# Altium project FMU3_REV_D.PrjPcb (part 1 of 2)
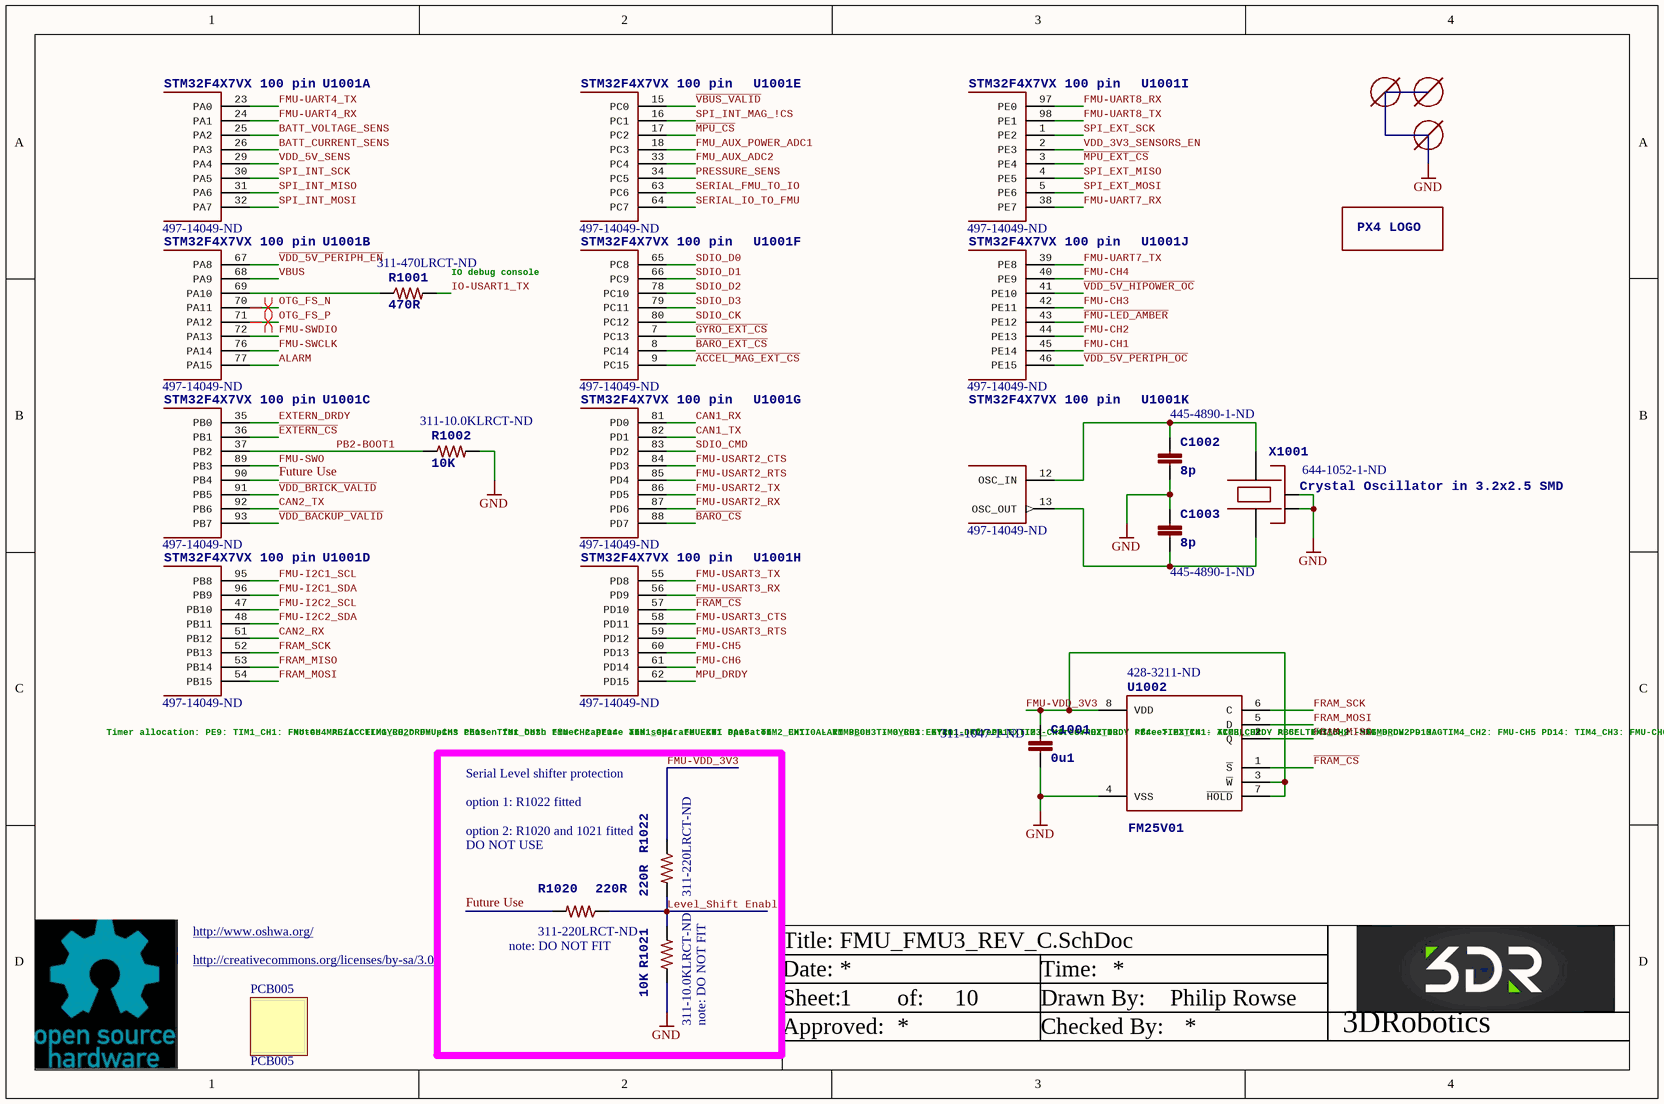
[diagram p0: FMU_FMU3_REV_C.SchDoc]
11 sheets, 168 parts. Net scope: global (net labels, ports and power ports of the same name join across sheets).
Board file: FMU3_REV_D.PcbDoc
Sheets:
  FMU_FMU3_REV_C.SchDoc
  SD_USB_FMU3_REV_C.SchDoc
  SERIAL_FMU3_REV_C.SchDoc
  SENSORS_FMU3_REV_C.SchDoc
  FMU_Power_FMU3_REV_C.SchDoc
  LEDs_FMU3_REV_C.SchDoc
  IO_FMU3_REV_C.SchDoc
  PWM_PPM_FMU3_REV_C.SchDoc
  80PIN_FMU3_REV_C.SchDoc
  IO_PWR_FMU3_REV_C.SchDoc
  CHANGE_FMU3_REV_D.SchDoc

## Sheet FMU_FMU3_REV_C.SchDoc
size A4; DrawnBy: Philip Rowse; SheetNumber: 1; SheetTotal: 10

### Parts
C1001  0u1  Supplier Part Number 1: 311-1047-1-ND  [0402-CAP]
C1002  8p  Supplier Part Number 1: 445-4890-1-ND  [0402-CAP]
C1003  8p  Supplier Part Number 1: 445-4890-1-ND  [0402-CAP]
M3_MOUNT1001  MOUNT-HOLE1.8MM  [MOUNT-HOLE1.8]  (value not drawn)
M3_MOUNT1003  MOUNT-HOLE1.8MM  [MOUNT-HOLE1.8]  (value not drawn)
M3_MOUNT1004  MOUNT-HOLE1.8MM  [MOUNT-HOLE1.8]  (value not drawn)
PCB005  PCB005
R1001  470R  Supplier Part Number 1: 311-470LRCT-ND  [0402-RES]
R1002  10K  Supplier Part Number 1: 311-10.0KLRCT-ND  [0402-RES]
R1020  220R  Supplier Part Number 1: 311-220LRCT-ND  note: DO NOT FIT  [0402-RES]
R1021  10K  Supplier Part Number 1: 311-10.0KLRCT-ND  note: DO NOT FIT  [0402-RES]
R1022  220R  Supplier Part Number 1: 311-220LRCT-ND  [0402-RES]
U1001  STM32F4X7VX 100 pin  Supplier Part Number 1: 497-14049-ND  [TQFP100]  (parts A,B,C,D,E,F,G,H,I,J,K of 14)
U1002  FM25V01  Supplier Part Number 1: 428-3211-ND  [SO08]
U$4  PX4-LOGO-10MM  [PX4-LOGO-10MM]  (value not drawn)
X1001  Crystal Oscillator in 3.2x2.5 SMD  Supplier Part Number 1: 644-1052-1-ND  [OSCILLATOR-3.2X2.5]

### Nets
GND: C1001.P$2 C1002.P$2 C1003.P$1 R1002.P$2 R1021.P$1 U1002.4(VSS) X1001.2(NC_2) X1001.4(NC_4)
~{ACCEL_MAG_EXT_CS}: U1001.9(PC15)
ALARM: U1001.77(PA15)
~{BARO_CS}: U1001.88(PD7)
~{BARO_EXT_CS}: U1001.8(PC14)
BATT_CURRENT_SENS: U1001.26(PA3)
BATT_VOLTAGE_SENS: U1001.25(PA2)
CAN1_RX: U1001.81(PD0)
CAN1_TX: U1001.82(PD1)
CAN2_RX: U1001.51(PB12)
CAN2_TX: U1001.92(PB6)
~{EXTERN_CS}: U1001.36(PB1)
EXTERN_DRDY: U1001.35(PB0)
~{FMU-LED_AMBER}: U1001.43(PE12)
~{FRAM_CS}: U1001.57(PD10) U1002.1(~{S})
FMU-CH1: U1001.45(PE14)
FMU-CH2: U1001.44(PE13)
FMU-CH3: U1001.42(PE11)
FMU-CH4: U1001.40(PE9)
FMU-CH5: U1001.60(PD13)
FMU-CH6: U1001.61(PD14)
FMU-I2C1_SCL: U1001.95(PB8)
FMU-I2C1_SDA: U1001.96(PB9)
FMU-I2C2_SCL: U1001.47(PB10)
FMU-I2C2_SDA: U1001.48(PB11)
FMU-SWCLK: U1001.76(PA14)
FMU-SWDIO: U1001.72(PA13)
FMU-SWO: U1001.89(PB3)
FMU-UART4_RX: U1001.24(PA1)
FMU-UART4_TX: U1001.23(PA0)
FMU-UART7_RX: U1001.38(PE7)
FMU-UART7_TX: U1001.39(PE8)
FMU-UART8_RX: U1001.97(PE0)
FMU-UART8_TX: U1001.98(PE1)
FMU-USART2_CTS: U1001.84(PD3)
FMU-USART2_RTS: U1001.85(PD4)
FMU-USART2_RX: U1001.87(PD6)
FMU-USART2_TX: U1001.86(PD5)
FMU-USART3_CTS: U1001.58(PD11)
FMU-USART3_RTS: U1001.59(PD12)
FMU-USART3_RX: U1001.56(PD9)
FMU-USART3_TX: U1001.55(PD8)
FMU-VDD_3V3: C1001.P$1 R1022.P$1 U1002.3(~{W}) U1002.7(~{HOLD}) U1002.8(VDD)
FMU_AUX_ADC2: U1001.33(PC4)
FMU_AUX_POWER_ADC1: U1001.18(PC3)
FRAM_MISO: U1001.53(PB14) U1002.2(Q)
FRAM_MOSI: U1001.54(PB15) U1002.5(D)
FRAM_SCK: U1001.52(PB13) U1002.6(C)
Future Use: R1020.P$2 U1001.90(PB4)
~{GYRO_EXT_CS}: U1001.7(PC13)
IO-USART1_TX: R1001.P$2
Level_Shift Enable: R1020.P$1 R1021.P$2 R1022.P$2
~{MPU_CS}: U1001.17(PC2)
~{MPU_EXT_CS}: U1001.3(PE4)
MPU_DRDY: U1001.62(PD15)
OTG_FS_N: U1001.70(PA11)
OTG_FS_P: U1001.71(PA12)
PB2-BOOT1: R1002.P$1 U1001.37(PB2)
PRESSURE_SENS: U1001.34(PC5)
SDIO_CK: U1001.80(PC12)
SDIO_CMD: U1001.83(PD2)
SDIO_D0: U1001.65(PC8)
SDIO_D1: U1001.66(PC9)
SDIO_D2: U1001.78(PC10)
SDIO_D3: U1001.79(PC11)
SERIAL_FMU_TO_IO: U1001.63(PC6)
SERIAL_IO_TO_FMU: U1001.64(PC7)
SPI_EXT_MISO: U1001.4(PE5)
SPI_EXT_MOSI: U1001.5(PE6)
SPI_EXT_SCK: U1001.1(PE2)
SPI_INT_MAG_!CS: U1001.16(PC1)
SPI_INT_MISO: U1001.31(PA6)
SPI_INT_MOSI: U1001.32(PA7)
SPI_INT_SCK: U1001.30(PA5)
~{VBUS_VALID}: U1001.15(PC0)
~{VDD_5V_HIPOWER_OC}: U1001.41(PE10)
~{VDD_5V_PERIPH_EN}: U1001.67(PA8)
~{VDD_5V_PERIPH_OC}: U1001.46(PE15)
~{VDD_BACKUP_VALID}: U1001.93(PB7)
~{VDD_BRICK_VALID}: U1001.91(PB5)
VBUS: U1001.68(PA9)
VDD_3V3_SENSORS_EN: U1001.2(PE3)
VDD_5V_SENS: U1001.29(PA4)
NetC1002_P$1: C1002.P$1 U1001.12(OSC_IN) X1001.3
NetC1003_P$2: C1003.P$2 U1001.13(OSC_OUT) X1001.1
NetR1001_P$1: R1001.P$1 U1001.69(PA10)

### Layout directives
differential pair: OTG_FS_N, OTG_FS_P

### Notes on the sheet
- (near R1001) IO debug console
- Timer allocation:
  PE9: TIM1_CH1: FMU-CH4
  PE11: TIM1_CH2: FMU-CH3
  PE13: TIM1_CH3: FMU-CH2
  PE14: TIM1_CH4: FMU-CH1
  PA15: TIM2_CH1: ALARM
  PB0: TIM3_CH3: GYRO1_DRDY
  PB1: TIM3_CH4: GYRO2_DRDY
  PB4: TIM3_CH1: ACCEL_DRDY
  PB5: TIM3_CH2: MAG_DRDY
  PD13: TIM4_CH2: FMU-CH5
  PD14: TIM4_CH3: FMU-CH6
  PD15: TIM4_CH4: spare
- Note: MAG/ACCEL/GYRO_DRDY pins chosen
  for both timer capture and separate
  EXTI operaton.
  EXTI0 - TIM3_CH3 - GYRO1
  EXTI1 - <free>
  EXTI2 - <free>
  EXTI3 - <free>
  EXTI4 - TIM3_CH1 - ACCEL
  EXTI5-9 - TIM3_CH2 - MAG
- option 1: R1022 fitted
- (near R1022) option 2: R1020 and 1021 fitted
- Serial Level shifter protection
- DO NOT USE
- http://www.oshwa.org/
- http://creativecommons.org/licenses/by-sa/3.0/
- Title:
- Date:
- Time:
- Sheet:
- Approved:
- of:
- Drawn By:
- Checked By:
- 3DRobotics

### Library data of the parts
C1001 = CAP0402: CAP CER 0.1UF 16V Y5V 0402; PARTNO: CC0402ZRY5V7BB104; 3DR_PARTNO: ECM0700; Supplier 1: Digi-Key; Value: 0u1
C1002 C1003 = CAP0402: CAP CER 8PF 50V C0G 0402; PARTNO: C1005C0G1H080C; 3DR_PARTNO: ECM0710; Supplier 1: Digi-Key; Value: 8p
M3_MOUNT1001 M3_MOUNT1003 M3_MOUNT1004 = MOUNT-HOLE1.8MM: BOM: EXCLUDE; PARTNO: *
PCB005 = PCB_0005: PCB,FMU, PX2, Board; 3DR_PARTNO: PCB005; Value: PCB005
R1001 = RESISTOR0402-RES: RES 470 OHM 1/16W 1% 0402 SMD; PARTNO: RC0402FR-07470RL; 3DR_PARTNO: ECM0823; Supplier 1: Digi-Key; Value: 470R
R1002 R1021 = RESISTOR0402-RES: RES 10K OHM 1/16W 1% 0402 SMD; PARTNO: RC0402FR-0710KL; 3DR_PARTNO: ECM0800; Supplier 1: Digi-Key; Value: 10K
R1020 R1022 = RESISTOR0402-RES: RES 220 OHM 1/16W 1% 0402 SMD; PARTNO: RC0402FR-07220RL; 3DR_PARTNO: ECM0821; Supplier 1: Digi-Key; Value: 220R
U1001 = STM32F4X7VX: REV 3 Silicon or later IC MCU ARM 2MB FLASH 100LQFP; 3DR_PARTNO: ECM0841; Supplier 1: Digi-Key
U1002 = FM25V01: IC FRAM 128KBIT 40MHZ 8SOIC; PARTNO: FM25V01-G; 3DR_PARTNO: ECM0826; Value: 128k; DATASHEET: http://www.ramtron.com/files/datasheets/FM25V01_ds.pdf; LINK: http://www.digikey.com/product-detail/en/FM25V01-GTR/1140-1026-1-ND/2809832; MFGPN: FM25V01; Supplier 1: Digi-Key
X1001 = OSCILLATOR-3.2X2.5: CRYSTAL 24MHZ 8PF SMD; 3DR_PARTNO: ECM0708; PARTNO: NX3225SA-24.000MHZ-STD-CSR-1; Supplier 1: Digi-Key; Value: 24MHz
U$4 = PX4-LOGO-10MM: PX4 LOGO: PX4 LOGO

## Sheet SD_USB_FMU3_REV_C.SchDoc: Pixhawk_mini_8L.sch
size A4; Date: 18/08/2014 1:53:11 PM; DrawnBy: Philip Rowse; SheetNumber: 2; SheetTotal: 10
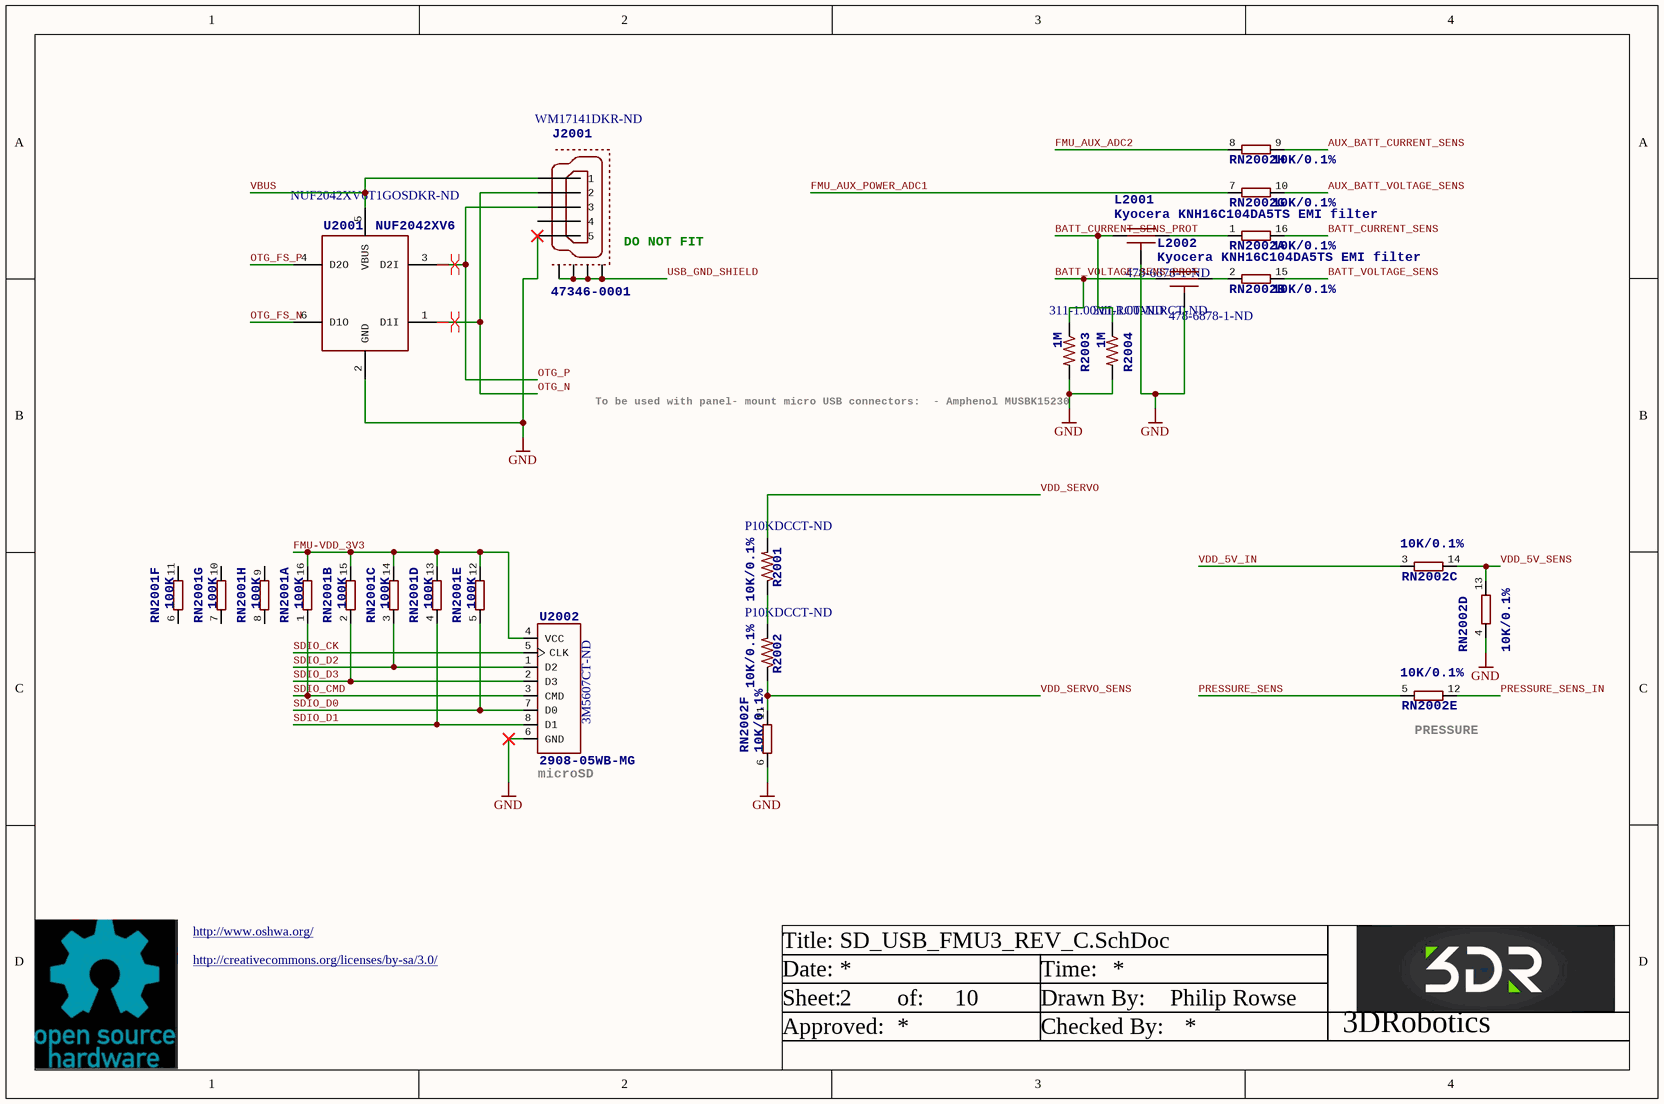
[diagram p1: SD_USB_FMU3_REV_C.SchDoc]

### Parts
J2001  47346-0001  Supplier Part Number 1: WM17141DKR-ND  [MOLEX-47346-0001]
L2001  Kyocera KNH16C104DA5TS EMI filter  Supplier Part Number 1: 478-6878-1-ND  [KYOCERA-KNH16-DA]
L2002  Kyocera KNH16C104DA5TS EMI filter  Supplier Part Number 1: 478-6878-1-ND  [KYOCERA-KNH16-DA]
R2001  10K/0.1%  Supplier Part Number 1: P10KDCCT-ND  [0402-RES]
R2002  10K/0.1%  Supplier Part Number 1: P10KDCCT-ND  [0402-RES]
R2003  1M  Supplier Part Number 1: 311-1.00MLRCT-ND  [0402-RES]
R2004  1M  Supplier Part Number 1: 311-1.00MLRCT-ND  [0402-RES]
RN2001  100K  [EXB2HV]  (parts A,B,C,D,E,F,G,H of 8)
RN2002  10K/0.1%  [EXB2HV]  (parts A,B,C,D,E,F,G,H of 8)
U2001  NUF2042XV6  Supplier Part Number 1: NUF2042XV6T1GOSDKR-ND  [SOT563-6]
U2002  2908-05WB-MG  Supplier Part Number 1: 3M5607CT-ND  [MICROSD]

### Nets
GND: J2001.GND(5) L2001.GND L2002.GND R2003.P$2 R2004.P$2 RN2002.4 RN2002.6 U2001.2(GND) U2002.6(GND)
AUX_BATT_CURRENT_SENS: RN2002.9
AUX_BATT_VOLTAGE_SENS: RN2002.10
BATT_CURRENT_SENS: RN2002.16
BATT_CURRENT_SENS_PROT: L2001.P$1 R2004.P$1
BATT_VOLTAGE_SENS: RN2002.15
BATT_VOLTAGE_SENS_PROT: L2002.P$1 R2003.P$1
FMU-VDD_3V3: RN2001.12 RN2001.13 RN2001.14 RN2001.15 RN2001.16 U2002.4(VCC)
FMU_AUX_ADC2: RN2002.8
FMU_AUX_POWER_ADC1: RN2002.7
OTG_FS_N: U2001.6(D1O)
OTG_FS_P: U2001.4(D2O)
OTG_N: J2001.D-(2) U2001.1(D1I)
OTG_P: J2001.D+(3) U2001.3(D2I)
PRESSURE_SENS: RN2002.5
PRESSURE_SENS_IN: RN2002.12
SDIO_CK: U2002.5(CLK)
SDIO_CMD: RN2001.1 U2002.3(CMD)
SDIO_D0: RN2001.5 U2002.7(D0)
SDIO_D1: RN2001.4 U2002.8(D1)
SDIO_D2: RN2001.3 U2002.1(D2)
SDIO_D3: RN2001.2 U2002.2(D3)
USB_GND_SHIELD: J2001.GND1 J2001.GND2 J2001.GND3 J2001.GND4
VBUS: J2001.VBUS(1) U2001.5(VBUS)
VDD_5V_IN: RN2002.3
VDD_5V_SENS: RN2002.13 RN2002.14
VDD_SERVO: R2001.P$2
VDD_SERVO_SENS: R2002.P$1 RN2002.11
NetL2001_P$2: L2001.P$2 RN2002.1
NetL2002_P$2: L2002.P$2 RN2002.2
NetR2001_P$1: R2001.P$1 R2002.P$2

Not connected (* = marked no-connect by the designer): J2001 ID(4); RN2001 6(1) 7(1) 8(1) 9(2) 10(2) 11(2)

### Layout directives
differential pair: OTG_N, OTG_P

### Notes on the sheet
- (near J2001) DO NOT FIT
- To be used with panel-
  mount micro USB connectors:
  - Amphenol MUSBK15230
- (near RN2002) PRESSURE
- (near U2002) microSD
- http://www.oshwa.org/
- http://creativecommons.org/licenses/by-sa/3.0/
- Title:
- Date:
- Time:
- Sheet:
- Approved:
- of:
- Drawn By:
- Checked By:
- 3DRobotics

### Library data of the parts
J2001 = MOLEX-47346-0001: MICRO USB B, BOTTOM MOUNT; 3DR_PARTNO: ECM0486; PARTNO: 0473460001; Supplier 1: Digi-Key
L2001 L2002 = KNH16C104DA5TS: FILTER CAP 0.1UF 2A 25V 0603; 3DR_PARTNO: ECM0719; Value: 0u1; Supplier 1: Digi-Key; PARTNO: KNH16C104DA5TS
R2001 R2002 = RESISTOR0402-RES: RES 10K OHM 1/16W .1% 0402 SMD; 3DR_PARTNO: ECM0810; PARTNO: ERA-2AEB103X; Supplier 1: Digi-Key; Value: 10K
R2003 R2004 = RESISTOR0402-RES: RES 1M OHM 1/16W 1% 0402 SMD; PARTNO: RC0402FR-071ML; 3DR_PARTNO: ECM0806; Supplier 1: Digi-Key; Value: 1M
RN2001 = 8R-NEXB2HV-100K: RES ARRAY 100K OHM 8 RES 1506; PARTNO: EXB-2HV104JV; 3DR_PARTNO: ECM0101; OC_FARNELL: unknown; OC_NEWARK: unknown; Supplier 1: Digi-Key; Supplier Part Number 1: Y1104CT-ND; Value: 100K
RN2002 = 8R-NEXB2HV-10K: RES ARRAY 10K OHM 8 RES 1506; PARTNO: EXB-2HV103JV; 3DR_PARTNO: ECM0546; OC_FARNELL: unknown; OC_NEWARK: unknown; Supplier 1: Digi-Key; Supplier Part Number 1: Y1103CT-ND; Value: 10K
U2001 = NUF2042XV6: IC FILTER USB ESD PROTECT SOT363; PARTNO: NUF2042XV6T1G; 3DR_PARTNO: ECM0836; Supplier 1: Digi-Key
U2002 = MICROSDSDI: CONN MICRO SD CARD PUSH-PUSH R/A; 3DR_PARTNO: ECM0485; PARTNO: 2908-05WB-MG; Supplier 1: Digi-Key

## Sheet SERIAL_FMU3_REV_C.SchDoc: Pixhawk_mini_8L.sch
size A4; Date: 18/08/2014 1:53:13 PM; DrawnBy: Philip Rowse; SheetNumber: 3; SheetTotal: 10
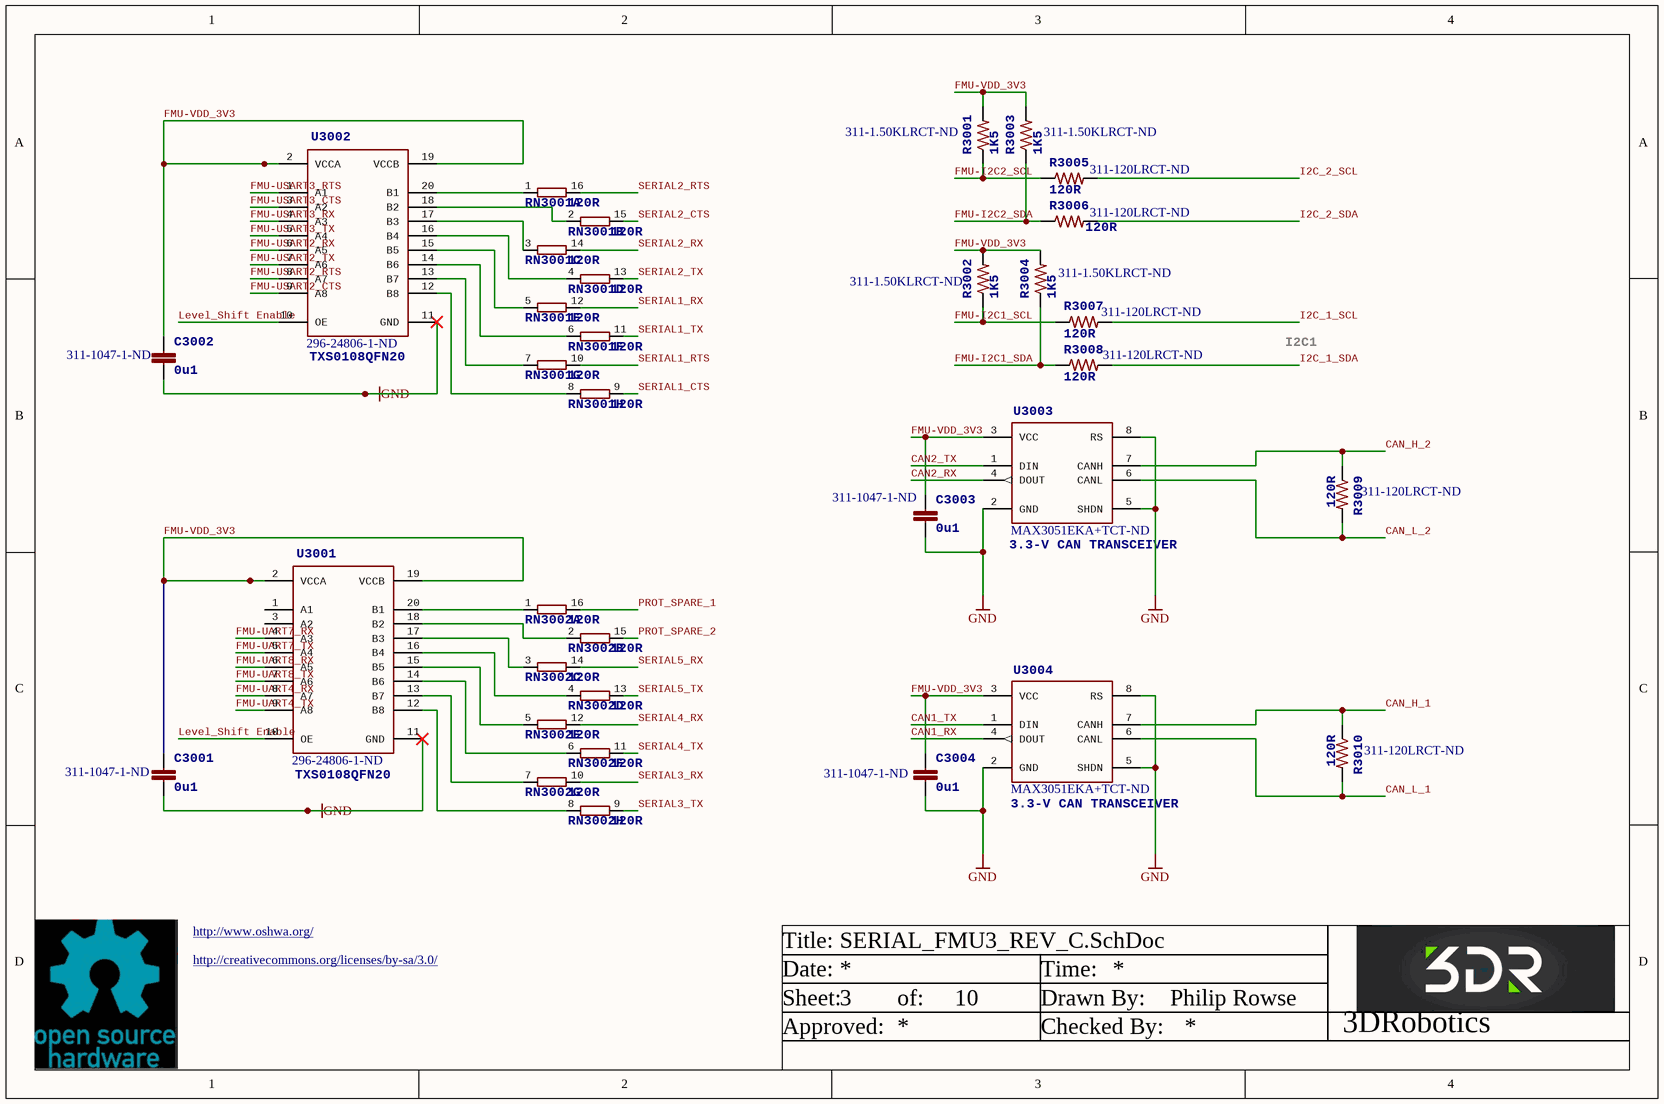
[diagram p2: SERIAL_FMU3_REV_C.SchDoc]

### Parts
C3001  0u1  Supplier Part Number 1: 311-1047-1-ND  [0402-CAP]
C3002  0u1  Supplier Part Number 1: 311-1047-1-ND  [0402-CAP]
C3003  0u1  Supplier Part Number 1: 311-1047-1-ND  [0402-CAP]
C3004  0u1  Supplier Part Number 1: 311-1047-1-ND  [0402-CAP]
R3001  1K5  Supplier Part Number 1: 311-1.50KLRCT-ND  [0402-RES]
R3002  1K5  Supplier Part Number 1: 311-1.50KLRCT-ND  [0402-RES]
R3003  1K5  Supplier Part Number 1: 311-1.50KLRCT-ND  [0402-RES]
R3004  1K5  Supplier Part Number 1: 311-1.50KLRCT-ND  [0402-RES]
R3005  120R  Supplier Part Number 1: 311-120LRCT-ND  [0402-RES]
R3006  120R  Supplier Part Number 1: 311-120LRCT-ND  [0402-RES]
R3007  120R  Supplier Part Number 1: 311-120LRCT-ND  [0402-RES]
R3008  120R  Supplier Part Number 1: 311-120LRCT-ND  [0402-RES]
R3009  120R  Supplier Part Number 1: 311-120LRCT-ND  [0402-RES]
R3010  120R  Supplier Part Number 1: 311-120LRCT-ND  [0402-RES]
RN3001  120R  [EXB2HV]  (parts A,B,C,D,E,F,G,H of 8)
RN3002  120R  [EXB2HV]  (parts A,B,C,D,E,F,G,H of 8)
U3001  TXS0108QFN20  Supplier Part Number 1: 296-24806-1-ND  [QFN20-RGY]
U3002  TXS0108QFN20  Supplier Part Number 1: 296-24806-1-ND  [QFN20-RGY]
U3003  3.3-V CAN TRANSCEIVER  Supplier Part Number 1: MAX3051EKA+TCT-ND  [SOT23-8]
U3004  3.3-V CAN TRANSCEIVER  Supplier Part Number 1: MAX3051EKA+TCT-ND  [SOT23-8]

### Nets
GND: C3001.P$2 C3002.P$2 C3003.P$2 C3004.P$2 U3001.11(GND) U3002.11(GND) U3003.2(GND) U3003.5(SHDN) U3003.8(RS) U3004.2(GND) U3004.5(SHDN) U3004.8(RS)
CAN1_RX: U3004.4(DOUT)
CAN1_TX: U3004.1(DIN)
CAN2_RX: U3003.4(DOUT)
CAN2_TX: U3003.1(DIN)
CAN_H_1: R3010.P$1 U3004.7(CANH)
CAN_H_2: R3009.P$1 U3003.7(CANH)
CAN_L_1: R3010.P$2 U3004.6(CANL)
CAN_L_2: R3009.P$2 U3003.6(CANL)
FMU-I2C1_SCL: R3002.P$1 R3007.P$1
FMU-I2C1_SDA: R3004.P$1 R3008.P$1
FMU-I2C2_SCL: R3001.P$1 R3005.P$1
FMU-I2C2_SDA: R3003.P$1 R3006.P$1
FMU-UART4_RX: U3001.8(A7)
FMU-UART4_TX: U3001.9(A8)
FMU-UART7_RX: U3001.4(A3)
FMU-UART7_TX: U3001.5(A4)
FMU-UART8_RX: U3001.6(A5)
FMU-UART8_TX: U3001.7(A6)
FMU-USART2_CTS: U3002.9(A8)
FMU-USART2_RTS: U3002.8(A7)
FMU-USART2_RX: U3002.6(A5)
FMU-USART2_TX: U3002.7(A6)
FMU-USART3_CTS: U3002.3(A2)
FMU-USART3_RTS: U3002.1(A1)
FMU-USART3_RX: U3002.4(A3)
FMU-USART3_TX: U3002.5(A4)
FMU-VDD_3V3: C3001.P$1 C3002.P$1 C3003.P$1 C3004.P$1 R3001.P$2 R3002.P$2 R3003.P$2 R3004.P$2 U3001.2(VCCA) U3001.19(VCCB) U3002.2(VCCA) U3002.19(VCCB) U3003.3(VCC) U3004.3(VCC)
I2C_1_SCL: R3007.P$2
I2C_1_SDA: R3008.P$2
I2C_2_SCL: R3005.P$2
I2C_2_SDA: R3006.P$2
Level_Shift Enable: U3001.10(OE) U3002.10(OE)
PROT_SPARE_1: RN3002.16
PROT_SPARE_2: RN3002.15
SERIAL1_CTS: RN3001.9
SERIAL1_RTS: RN3001.10
SERIAL1_RX: RN3001.12
SERIAL1_TX: RN3001.11
SERIAL2_CTS: RN3001.15
SERIAL2_RTS: RN3001.16
SERIAL2_RX: RN3001.14
SERIAL2_TX: RN3001.13
SERIAL3_RX: RN3002.10
SERIAL3_TX: RN3002.9
SERIAL4_RX: RN3002.12
SERIAL4_TX: RN3002.11
SERIAL5_RX: RN3002.14
SERIAL5_TX: RN3002.13
NetRN3001_1: RN3001.1 U3002.20(B1)
NetRN3001_2: RN3001.2 U3002.18(B2)
NetRN3001_3: RN3001.3 U3002.17(B3)
NetRN3001_4: RN3001.4 U3002.16(B4)
NetRN3001_5: RN3001.5 U3002.15(B5)
NetRN3001_6: RN3001.6 U3002.14(B6)
NetRN3001_7: RN3001.7 U3002.13(B7)
NetRN3001_8: RN3001.8 U3002.12(B8)
NetRN3002_1: RN3002.1 U3001.20(B1)
NetRN3002_2: RN3002.2 U3001.18(B2)
NetRN3002_3: RN3002.3 U3001.17(B3)
NetRN3002_4: RN3002.4 U3001.16(B4)
NetRN3002_5: RN3002.5 U3001.15(B5)
NetRN3002_6: RN3002.6 U3001.14(B6)
NetRN3002_7: RN3002.7 U3001.13(B7)
NetRN3002_8: RN3002.8 U3001.12(B8)

Not connected (* = marked no-connect by the designer): U3001 1(A1) 3(A2)

### Notes on the sheet
- I2C1
- http://www.oshwa.org/
- http://creativecommons.org/licenses/by-sa/3.0/
- Title:
- Date:
- Time:
- Sheet:
- Approved:
- of:
- Drawn By:
- Checked By:
- 3DRobotics

### Library data of the parts
C3001-C3004 = CAP0402: as C1001 on sheet FMU_FMU3_REV_C; Supplier 1: Digi-Key; Value: 0u1
R3001-R3004 = RESISTOR0402-RES: RES 1.5K OHM 1/16W 1% 0402 SMD; PARTNO: RC0402FR-071K5L; 3DR_PARTNO: ECM0803; Supplier 1: Digi-Key; Value: 1K5
R3005-R3010 = RESISTOR0402-RES: RES 120 OHM 1/16W 1% 0402 SMD; PARTNO: RC0402FR-07120RL; 3DR_PARTNO: ECM0820; Supplier 1: Digi-Key; Value: 120R
RN3001 RN3002 = 8R-NEXB2HV-120R: RES ARRAY 120 OHM 8 RES 1506; PARTNO: EXB-2HV121JV; 3DR_PARTNO: EMC; OC_FARNELL: unknown; OC_NEWARK: unknown; Supplier 1: Digi-Key; Supplier Part Number 1: Y1121CT-ND; Value: 120R
U3001 U3002 = TXS0108QFN20: IC XLATR VOLT-LVL 8B BDIR 20QFN; 3DR_PARTNO: ECM0845; PARTNO: TXS0108ERGYR; Supplier 1: Digi-Key
U3003 U3004 = MAX3051MAX3051EKA: IC TXRX CAN 1MBPS SOT23-8; 3DR_PARTNO: ECM0831; PARTNO: MAX3051EKA+T; Supplier 1: Digi-Key; Value: CAN

## Sheet SENSORS_FMU3_REV_C.SchDoc: Pixhawk_mini_8L.sch
size A4; Date: 18/08/2014 1:53:16 PM; DrawnBy: Philip Rowse; SheetNumber: 4; SheetTotal: 10
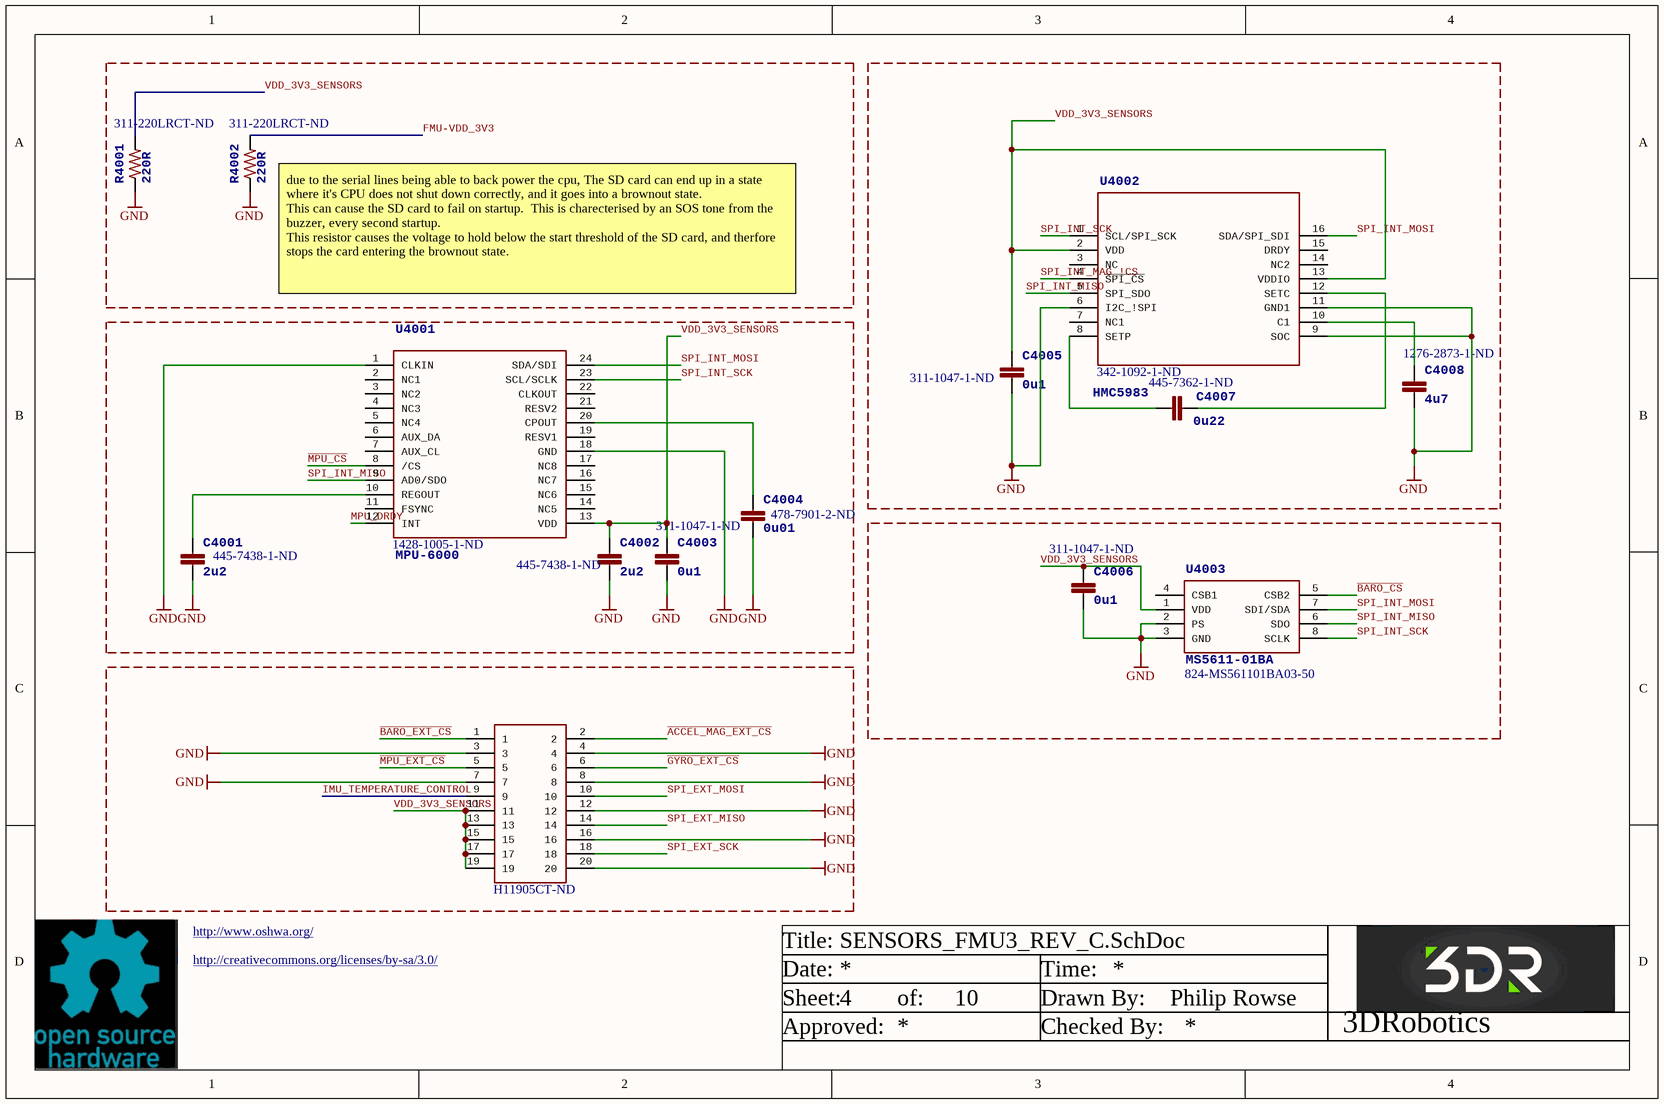
[diagram p3: SENSORS_FMU3_REV_C.SchDoc]

### Parts
C4001  2u2  Supplier Part Number 1: 445-7438-1-ND  [0603-CAP]
C4002  2u2  Supplier Part Number 1: 445-7438-1-ND  [0603-CAP]
C4003  0u1  Supplier Part Number 1: 311-1047-1-ND  [0402-CAP]
C4004  0u01  Supplier Part Number 1: 478-7901-2-ND  [0603-CAP]
C4005  0u1  Supplier Part Number 1: 311-1047-1-ND  [0402-CAP]
C4006  0u1  Supplier Part Number 1: 311-1047-1-ND  [0402-CAP]
C4007  0u22  Supplier Part Number 1: 445-7362-1-ND  [0402-CAP]
C4008  4u7  Supplier Part Number 1: 1276-2873-1-ND  [0805]
R4001  220R  Supplier Part Number 1: 311-220LRCT-ND  [0402-RES]
R4002  220R  Supplier Part Number 1: 311-220LRCT-ND  [0402-RES]
U4001  MPU-6000  Supplier Part Number 1: 1428-1005-1-ND  [QFN-24]
U4002  HMC5983  Supplier Part Number 1: 342-1092-1-ND  [HMC5983-new]
U4003  MS5611-01BA  Supplier Part Number 1: 824-MS561101BA03-50  [MS5611-01BA]
U$2  Supplier Part Number 1: H11905CT-ND  [DF-40C-20DS]  (hidden comment: DF40C-20-DS)

### Nets
GND: C4001.P$2 C4002.P$2 C4003.P$2 C4004.P$2 C4005.P$2 C4006.P$2 C4008.2 R4001.P$1 R4002.P$1 U4001.1(CLKIN) U4001.18(GND) U4002.6(I2C_!SPI) U4002.9(SOC) U4002.11(GND1) U4003.2(PS) U4003.3(GND) U$2.3 U$2.4 U$2.7 U$2.8 U$2.12 U$2.16 U$2.20
~{ACCEL_MAG_EXT_CS}: U$2.2
~{BARO_CS}: U4003.5(CSB2)
~{BARO_EXT_CS}: U$2.1
FMU-VDD_3V3: R4002.P$2
~{GYRO_EXT_CS}: U$2.6
IMU_TEMPERATURE_CONTROL: U$2.9
~{MPU_CS}: U4001.8(/CS)
~{MPU_EXT_CS}: U$2.5
MPU_DRDY: U4001.12(INT)
SPI_EXT_MISO: U$2.14
SPI_EXT_MOSI: U$2.10
SPI_EXT_SCK: U$2.18
SPI_INT_MAG_!CS: U4002.4(~{SPI_CS})
SPI_INT_MISO: U4001.9(AD0/SDO) U4002.5(SPI_SDO) U4003.6(SDO)
SPI_INT_MOSI: U4001.24(SDA/SDI) U4002.16(SDA/SPI_SDI) U4003.7(SDI/SDA)
SPI_INT_SCK: U4001.23(SCL/SCLK) U4002.1(SCL/SPI_SCK) U4003.8(SCLK)
VDD_3V3_SENSORS: C4002.P$1 C4003.P$1 C4005.P$1 C4006.P$1 R4001.P$2 U4001.13(VDD) U4002.2(VDD) U4002.13(VDDIO) U4003.1(VDD) U$2.11 U$2.13 U$2.15 U$2.17 U$2.19
NetC4001_P$1: C4001.P$1 U4001.10(REGOUT)
NetC4004_P$1: C4004.P$1 U4001.20(CPOUT)
NetC4007_P$1: C4007.P$1 U4002.12(SETC)
NetC4007_P$2: C4007.P$2 U4002.8(SETP)
NetC4008_1: C4008.1 U4002.10(C1)

Not connected (* = marked no-connect by the designer): U4001 2(NC1) 3(NC2) 4(NC3) 5(NC4) 6(AUX_DA) 7(AUX_CL) 11(FSYNC) 14(NC5) 15(NC6) 16(NC7) 17(NC8) 19(RESV1) 21(RESV2) 22(CLKOUT); U4002 3(NC) 7(NC1) 14(NC2) 15(DRDY); U4003 4(CSB1)

### Notes on the sheet
- (near R4002) due to the serial lines being able to back power the cpu, The SD card can end up in a state where it's CPU does not shut down correctly, and it goes into a brownout state.
  This can cause the SD card to fail on startup.  This is charecterised by an SOS tone from the buzzer, every second startup.
  This resistor causes the voltage to hold below the start threshold of the SD card, and therfore stops the card entering the brownout state.
- http://www.oshwa.org/
- http://creativecommons.org/licenses/by-sa/3.0/
- Title:
- Date:
- Time:
- Sheet:
- Approved:
- of:
- Drawn By:
- Checked By:
- 3DRobotics

### Library data of the parts
C4001 C4002 = CAP0603: CAP CER 2.2UF 16V 10% X6S 0603; PARTNO: C1608X6S1C225K080AC; 3DR_PARTNO: ECM0619; Supplier 1: Digi-Key; Value: 2u2
C4003 C4006 = CAP0402: as C1001 on sheet FMU_FMU3_REV_C; Supplier 1: Digi-Key; Value: 0u1
C4004 = CAP0603: CAP CER 10000PF 25V 5% X7R 0603; PARTNO: 06033C103JAT2A; 3DR_PARTNO: ECM0620; Supplier 1: Digi-Key; Value: 0u01
C4005 = CAP0402: CAP CER 0.1UF 16V Y5V 0402; 3DR_PARTNO: ECM0700; PARTNO: CC0402ZRY5V7BB104; Supplier 1: Digi-Key; Value: 0u1
C4007 = CAP0402: CAP CER 0.22UF 25V 10% X7R 0402; 3DR_PARTNO: ECM; PARTNO: C1005X6S1E224K050BC; Value: 0u22; Supplier 1: Digi-Key
C4008 = CAP0805: CAP CER 4.7UF 16V 10% X7R 0805; PARTNO: CL21B475KOFNNNE; 3DR_PARTNO: ECM0622; DATASHEET: http://www.digikey.com/product-detail/en/CL21B475KOFNNNE/1276-2873-2-ND/3888531; Supplier 1: Digi-Key; Value: 4u7
R4001 R4002 = RESISTOR0402-RES: RES 220 OHM 1/16W 1% 0402 SMD; 3DR_PARTNO: ECM0821; PARTNO: RC0402FR-07220RL; Supplier 1: Digi-Key; Value: 220R
U4001 = MPU-6000: GYRO/ACCELEROMETER 6AXIS 24QFN; 3DR_PARTNO: ECM0834; DATASHEET: http://invensense.com/mems/gyro/documents/PS-MPU-6000A-00_v1.0.pdf; LINK: http://invensense.com/mems/gyro/mpu6000.html; MFGPN: MPU-6000; Supplier 1: Digi-Key; PARTNO: MPU-6000
U4002 = HMC5983: IC COMPASS 3 AXIS 16-LCC; 3DR_PARTNO: ECM0672; PARTNO: HMC5983; Supplier 1: Digi-Key
U4003 = MS5611-01BA: Board Mount Pressure Sensors; 3DR_PARTNO: ECM0835; Value: 10-1200mbar; DATASHEET: http://www.meas-spec.com/downloads/MS5611-01BA01.pdf; LINK: http://www.meas-spec.com/product/t_product.aspx?id=8503#; MFGPN: MS5611-01BA; PARTNO: MS5611-01BA; Supplier 1: Mouser
U$2 = DF40C-20-DS: CONN RCPT 20POS 0.4MM SMD GOLD; 3DR_PARTNO: ECM0517; PARTNO: DF40C(2.0)-20DS-0.4V(51); Supplier 1: Digi-Key

## Sheet FMU_Power_FMU3_REV_C.SchDoc: Pixhawk_mini_8L.sch
size A4; Date: 18/08/2014 1:53:18 PM; DrawnBy: Philip Rowse; SheetNumber: 5; SheetTotal: 10
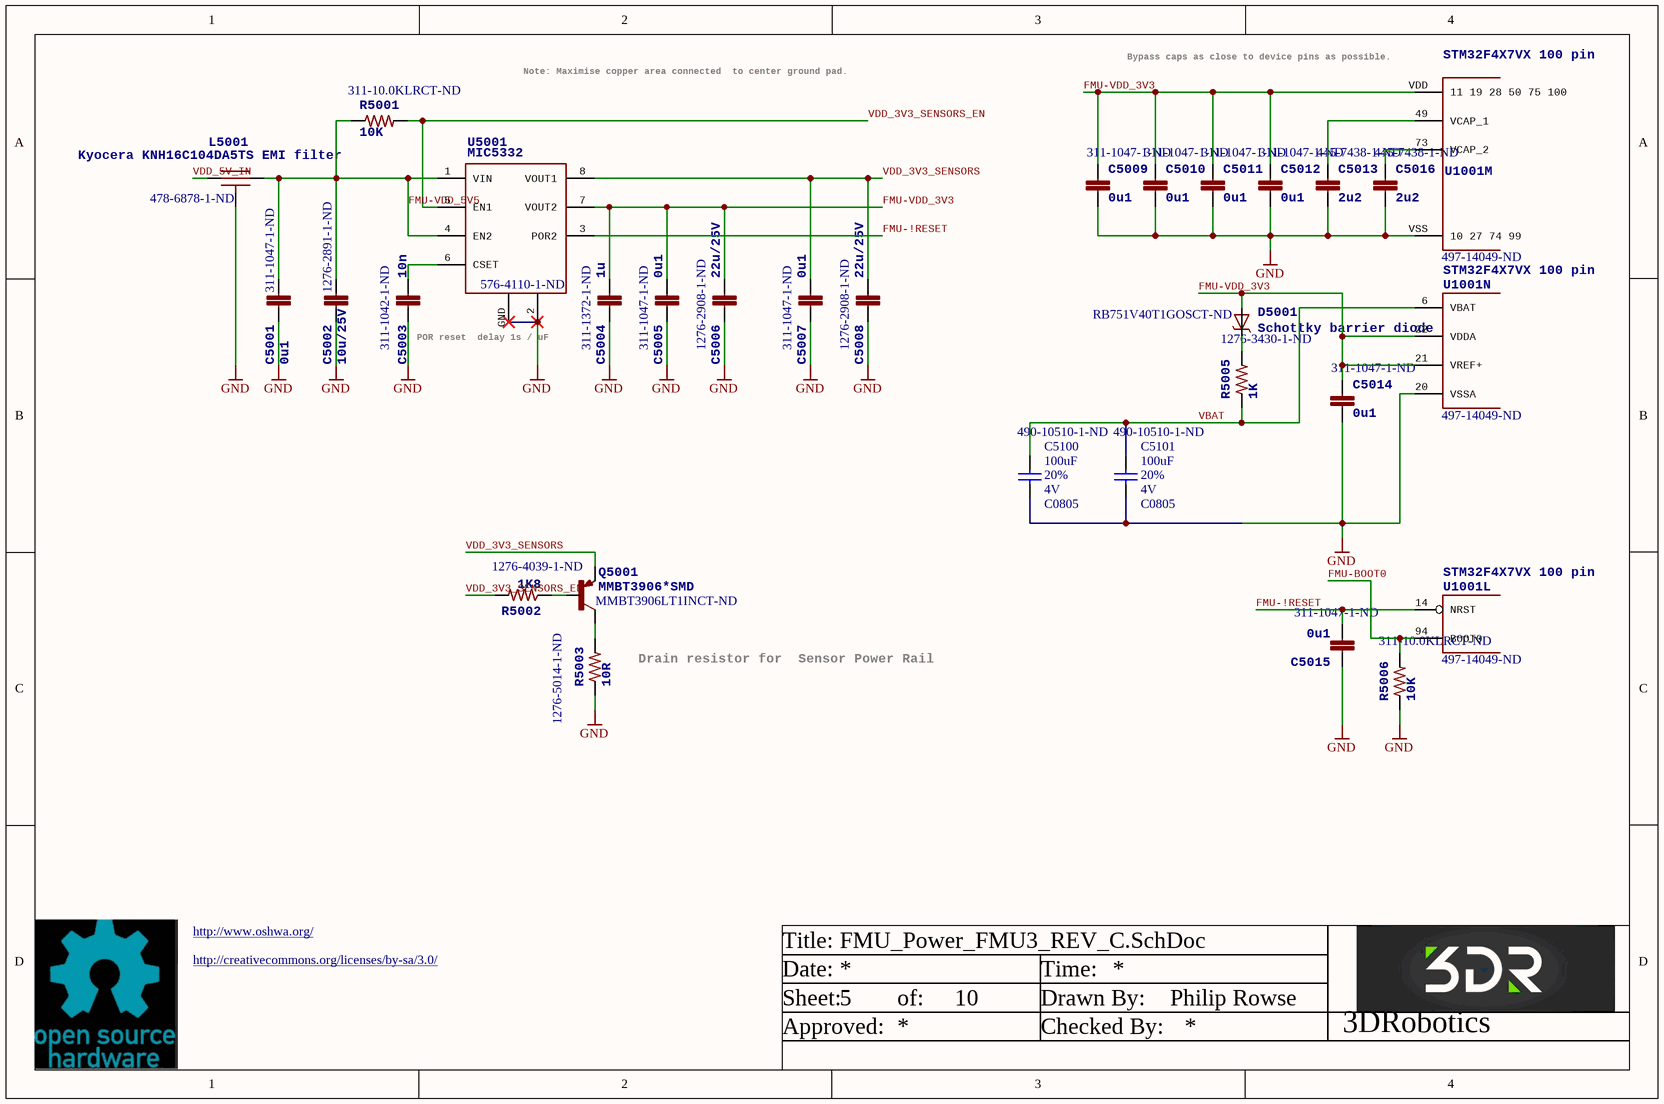
[diagram p4: FMU_Power_FMU3_REV_C.SchDoc]

### Parts
C5001  0u1  Supplier Part Number 1: 311-1047-1-ND  [0402-CAP]
C5002  10u/25V  Supplier Part Number 1: 1276-2891-1-ND  [0805-CAP]
C5003  10n  Supplier Part Number 1: 311-1042-1-ND  [0402-CAP]
C5004  1u  Supplier Part Number 1: 311-1372-1-ND  [0603-CAP]
C5005  0u1  Supplier Part Number 1: 311-1047-1-ND  [0402-CAP]
C5006  22u/25V  Supplier Part Number 1: 1276-2908-1-ND  [0805-CAP]
C5007  0u1  Supplier Part Number 1: 311-1047-1-ND  [0402-CAP]
C5008  22u/25V  Supplier Part Number 1: 1276-2908-1-ND  [0805-CAP]
C5009  0u1  Supplier Part Number 1: 311-1047-1-ND  [0402-CAP]
C5010  0u1  Supplier Part Number 1: 311-1047-1-ND  [0402-CAP]
C5011  0u1  Supplier Part Number 1: 311-1047-1-ND  [0402-CAP]
C5012  0u1  Supplier Part Number 1: 311-1047-1-ND  [0402-CAP]
C5013  2u2  Supplier Part Number 1: 445-7438-1-ND  [0603-CAP]
C5014  0u1  Supplier Part Number 1: 311-1047-1-ND  [0402-CAP]
C5015  0u1  Supplier Part Number 1: 311-1047-1-ND  [0402-CAP]
C5016  2u2  Supplier Part Number 1: 445-7438-1-ND  [0603-CAP]
C5100  value 100uF  Tolerance: 20%  Voltage: 4V  Supplier Part Number 1: 490-10510-1-ND  [C0805]  (hidden comment: GRM21BR60G107ME15L)
C5101  value 100uF  Tolerance: 20%  Voltage: 4V  Supplier Part Number 1: 490-10510-1-ND  [C0805]  (hidden comment: GRM21BR60G107ME15L)
D5001  Schottky barrier diode  Supplier Part Number 1: RB751V40T1GOSCT-ND  [SOD323]
L5001  Kyocera KNH16C104DA5TS EMI filter  Supplier Part Number 1: 478-6878-1-ND  [KYOCERA-KNH16-DA]
Q5001  MMBT3906*SMD  Supplier Part Number 1: MMBT3906LT1INCT-ND  [SOT23-BEC]
R5001  10K  Supplier Part Number 1: 311-10.0KLRCT-ND  [0402-RES]
R5002  1K8  Supplier Part Number 1: 1276-4039-1-ND  [0402-RES]
R5003  10R  Supplier Part Number 1: 1276-5014-1-ND  [0603-RES]
R5005  1K  Supplier Part Number 1: 1276-3430-1-ND  [0402-RES]
R5006  10K  Supplier Part Number 1: 311-10.0KLRCT-ND  [0402-RES]
U1001  STM32F4X7VX 100 pin  Supplier Part Number 1: 497-14049-ND  [TQFP100]  (parts L,M,N of 14)
U5001  MIC5332  Supplier Part Number 1: 576-4110-1-ND  [MLF-8-EPAD]

### Nets
GND: C5001.P$2 C5002.P$2 C5003.P$1 C5004.P$2 C5005.P$2 C5006.P$2 C5007.P$2 C5008.P$2 C5009.P$2 C5010.P$2 C5011.P$2 C5012.P$2 C5013.P$2 C5014.P$2 C5015.P$1 C5016.P$2 C5100.1 C5101.1 L5001.GND R5003.1 R5006.P$1 U1001.20(VSSA) U1001.VSS(10_27_74_99) U5001.2(GND) U5001.GND
FMU-!RESET: C5015.P$2 U1001.14(NRST) U5001.3(POR2)
FMU-BOOT0: R5006.P$2 U1001.94(BOOT0)
FMU-VDD_3V3: C5004.P$1 C5005.P$1 C5006.P$1 C5009.P$1 C5010.P$1 C5011.P$1 C5012.P$1 C5014.P$1 D5001.A U1001.21(VREF+) U1001.22(VDDA) U1001.VDD(11_19_28_50_75_100) U5001.7(VOUT2)
FMU-VDD_5V5: C5001.P$1 C5002.P$1 L5001.P$2 R5001.P$1 U5001.1(VIN) U5001.4(EN2)
VBAT: C5100.2 C5101.2 R5005.P$1 U1001.6(VBAT)
VDD_3V3_SENSORS: C5007.P$1 C5008.P$1 Q5001.E U5001.8(VOUT1)
VDD_3V3_SENSORS_EN: R5001.P$2 R5002.P$2 U5001.5(EN1)
VDD_5V_IN: L5001.P$1
NetC5003_P$2: C5003.P$2 U5001.6(CSET)
NetC5013_P$1: C5013.P$1 U1001.49(VCAP_1)
NetC5016_P$1: C5016.P$1 U1001.73(VCAP_2)
NetD5001_C: D5001.C R5005.P$2
NetQ5001_B: Q5001.B R5002.P$1
NetQ5001_C: Q5001.C R5003.2

### Notes on the sheet
- Note: Maximise copper area connected
  to center ground pad.
- Bypass caps as close to device pins as possible.
- POR reset
  delay 1s / uF
- Drain resistor for
  Sensor Power Rail
- http://www.oshwa.org/
- http://creativecommons.org/licenses/by-sa/3.0/
- Title:
- Date:
- Time:
- Sheet:
- Approved:
- of:
- Drawn By:
- Checked By:
- 3DRobotics

### Library data of the parts
C5001 C5005 C5007 C5009-C5012 C5014 C5015 = CAP0402: as C1001 on sheet FMU_FMU3_REV_C; Supplier 1: Digi-Key; Value: 0u1
C5002 = CAP0805: CAP CER 10UF 25V 10% X5R 0805; PARTNO: CL21A106KAYNNNE; 3DR_PARTNO: ECM0714; Value: 10u/25; Supplier 1: Digi-Key
C5003 = CAP0402: CAP CER 10000PF 16V 10% X7R 0402; PARTNO: CC0402KRX7R7BB103; 3DR_PARTNO: ECM0711; Supplier 1: Digi-Key; Value: 10n
C5004 = CAP0603: CAP CER 1UF 16V Y5V 0603; PARTNO: CC0603ZRY5V7BB105; 3DR_PARTNO: ECM0705; Supplier 1: Digi-Key; Value: 1u
C5006 C5008 = CAP0805: CAP CER 22UF 25V 20% X5R 0805; PARTNO: CL21A226MAQNNNE; 3DR_PARTNO: ECM0715; Supplier 1: Digi-Key; Value: 22u/25V
C5013 C5016 = CAP0603: as C4001 on sheet SENSORS_FMU3_REV_C; Supplier 1: Digi-Key; Value: 2u2
C5100 C5101 = Capacitor: Supplier 1: Digi-Key
D5001 = DIODE-SCHOTTKY_SOD323: DIODE SCHOTTKY 30V 0.03A SOD323; 3DR_PARTNO: ECM0839; PARTNO: RB751V40T1G; Supplier 1: Digi-Key; Value: 30V
L5001 = KNH16C104DA5TS: as L2001 on sheet SD_USB_FMU3_REV_C; Supplier 1: Digi-Key; PARTNO: KNH16C104DA5TS
Q5001 = MMBT3906*SMD: TRANSISTOR SWITCHING PNP SOT-23; 3DR_PARTNO: ECM0833; PARTNO: MMBT 3906 LT1; Supplier 1: Digi-Key
R5001 R5006 = RESISTOR0402-RES: as R1002 on sheet FMU_FMU3_REV_C; Supplier 1: Digi-Key; Value: 10K
R5002 = RESISTOR0402-RES: RES 1.8K OHM 1/16W 1% 0402; PARTNO: RC1005F182CS; 3DR_PARTNO: ECM0807; Supplier 1: Digi-Key; Value: 1K8
R5003 = RESISTOR0603-RES: RES 10 OHM 1/10W 5% 0603; PARTNO: RC1608J100CS; 3DR_PARTNO: ECM0811; Supplier 1: Digi-Key; Value: 10R
R5005 = RESISTOR0402-RES: RES 1K OHM 1/16W 1% 0402; PARTNO: RC1005F102CS; 3DR_PARTNO: ECM0804; Supplier 1: Digi-Key; Value: 1K
U1001 = STM32F4X7VX: as U1001 on sheet FMU_FMU3_REV_C; Supplier 1: Digi-Key
U5001 = MIC5332: IC REG LDO 3.3V 0.3A 8TMLF; 3DR_PARTNO: ECM0832; PARTNO: MIC5332-SSYMT TR; Supplier 1: Digi-Key; Value: 3.3V

## Sheet LEDs_FMU3_REV_C.SchDoc: Pixhawk_mini_8L.sch
size A4; Date: 18/08/2014 1:53:21 PM; DrawnBy: Philip Rowse; SheetNumber: 6; SheetTotal: 10
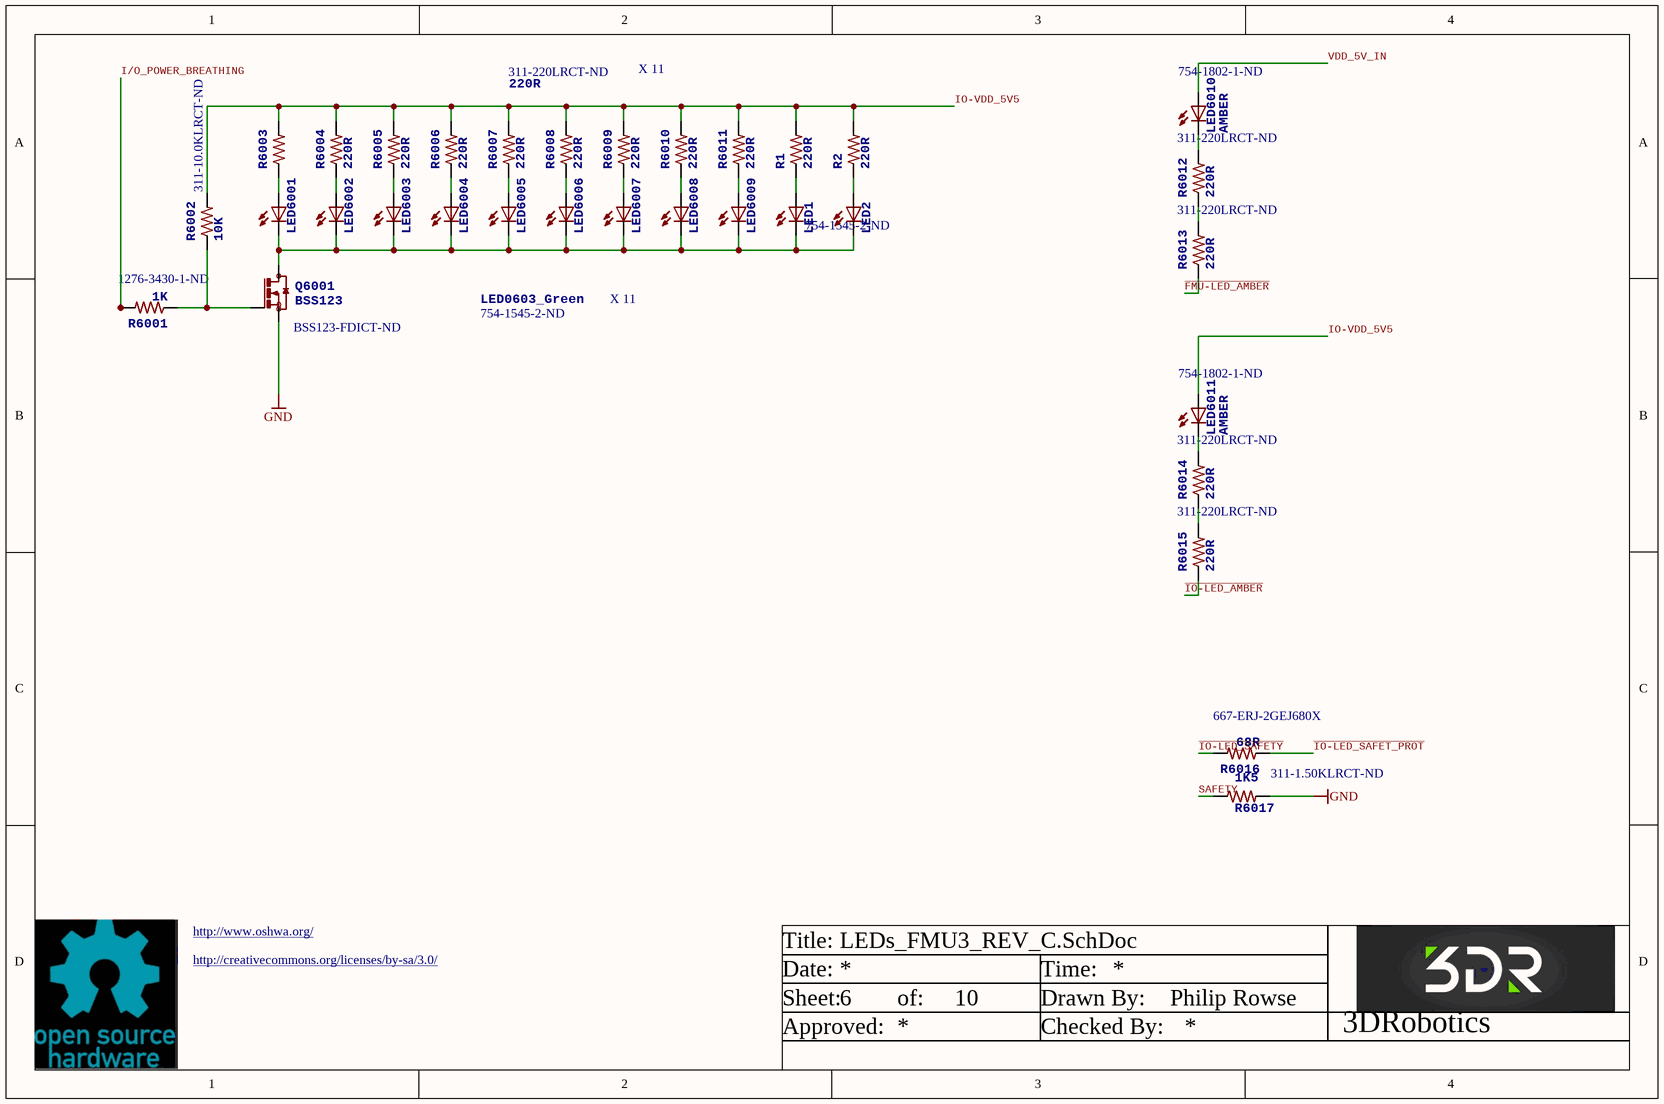
[diagram p5: LEDs_FMU3_REV_C.SchDoc]

### Parts
LED1  Supplier Part Number 1: 754-1545-2-ND  [0603-LED-Blue]  (hidden comment: LED0603_Green)
LED2  LED0603_Green  [0603-LED-Blue]  (value not drawn)
LED6001  LED0603_Green  Supplier Part Number 1: 754-1545-2-ND  [0603-LED-Blue]
LED6002  LED0603_Green  [0603-LED-Blue]  (value not drawn)
LED6003  LED0603_Green  [0603-LED-Blue]  (value not drawn)
LED6004  LED0603_Green  [0603-LED-Blue]  (value not drawn)
LED6005  LED0603_Green  [0603-LED-Blue]  (value not drawn)
LED6006  LED0603_Green  [0603-LED-Blue]  (value not drawn)
LED6007  LED0603_Green  [0603-LED-Blue]  (value not drawn)
LED6008  LED0603_Green  [0603-LED-Blue]  (value not drawn)
LED6009  LED0603_Green  [0603-LED-Blue]  (value not drawn)
LED6010  AMBER  Supplier Part Number 1: 754-1802-1-ND  [0603-LED]
LED6011  AMBER  Supplier Part Number 1: 754-1802-1-ND  [0603-LED]
Q6001  BSS123  Supplier Part Number 1: BSS123-FDICT-ND  [SOT23]
R1  220R  [0402-RES]
R2  220R  [0402-RES]
R6001  1K  Supplier Part Number 1: 1276-3430-1-ND  [0402-RES]
R6002  10K  Supplier Part Number 1: 311-10.0KLRCT-ND  [0402-RES]
R6003  220R  Supplier Part Number 1: 311-220LRCT-ND  [0402-RES]
R6004  220R  [0402-RES]
R6005  220R  [0402-RES]
R6006  220R  [0402-RES]
R6007  220R  [0402-RES]
R6008  220R  [0402-RES]
R6009  220R  [0402-RES]
R6010  220R  [0402-RES]
R6011  220R  [0402-RES]
R6012  220R  Supplier Part Number 1: 311-220LRCT-ND  [0402-RES]
R6013  220R  Supplier Part Number 1: 311-220LRCT-ND  [0402-RES]
R6014  220R  Supplier Part Number 1: 311-220LRCT-ND  [0402-RES]
R6015  220R  Supplier Part Number 1: 311-220LRCT-ND  [0402-RES]
R6016  68R  Supplier Part Number 1: 667-ERJ-2GEJ680X  [0402-RES]
R6017  1K5  Supplier Part Number 1: 311-1.50KLRCT-ND  [0402-RES]

### Nets
GND: Q6001.2(S) R6017.P$2
~{FMU-LED_AMBER}: R6013.P$1
I/O_POWER_BREATHING: R6001.P$2
~{IO-LED_AMBER}: R6015.P$1
~{IO-LED_SAFET_PROT}: R6016.P$1
~{IO-LED_SAFETY}: R6016.P$2
IO-VDD_5V5: LED6011.A R1.P$2 R2.P$2 R6002.P$2 R6003.P$2 R6004.P$2 R6005.P$2 R6006.P$2 R6007.P$2 R6008.P$2 R6009.P$2 R6010.P$2 R6011.P$2
SAFETY: R6017.P$1
VDD_5V_IN: LED6010.A
NetLED1_A: LED1.A R1.P$1
NetLED1_C: LED1.C LED2.C LED6001.C LED6002.C LED6003.C LED6004.C LED6005.C LED6006.C LED6007.C LED6008.C LED6009.C Q6001.3(D)
NetLED2_A: LED2.A R2.P$1
NetLED6001_A: LED6001.A R6003.P$1
NetLED6002_A: LED6002.A R6004.P$1
NetLED6003_A: LED6003.A R6005.P$1
NetLED6004_A: LED6004.A R6006.P$1
NetLED6005_A: LED6005.A R6007.P$1
NetLED6006_A: LED6006.A R6008.P$1
NetLED6007_A: LED6007.A R6009.P$1
NetLED6008_A: LED6008.A R6010.P$1
NetLED6009_A: LED6009.A R6011.P$1
NetLED6010_C: LED6010.C R6012.P$2
NetLED6011_C: LED6011.C R6014.P$2
NetQ6001_1: Q6001.1(G) R6001.P$1 R6002.P$1
NetR6012_P$1: R6012.P$1 R6013.P$2
NetR6014_P$1: R6014.P$1 R6015.P$2

### Notes on the sheet
- X 11
- http://www.oshwa.org/
- http://creativecommons.org/licenses/by-sa/3.0/
- Title:
- Date:
- Time:
- Sheet:
- Approved:
- of:
- Drawn By:
- Checked By:
- 3DRobotics

### Library data of the parts
LED1 LED2 LED6001-LED6009 = LED0603_Blue: LED GREEN ROUND CLEAR SMD; 3DR_PARTNO: ECM0494; PARTNO: APTD1608CGCK; Supplier 1: Digi-Key; Value: GREEN
  LED2 LED6002-LED6009: Supplier Part Number 1: 754-1545-2-ND
LED6010 LED6011 = LED0603: LED 1.6X0.8 DOME ORN CLEAR SMD; PARTNO: APTD1608SECK; 3DR_PARTNO: ECM0515; Supplier 1: Digi-Key; Value: AMBER
Q6001 = BSS123: MOSFET N-CH 100V 170MA SOT23-3; 3DR_PARTNO: ECM0547; PARTNO: BSS123; Supplier 1: Digi-Key; Value: 100V
R1 R2 R6003-R6015 = RESISTOR0402-RES: as R1020 on sheet FMU_FMU3_REV_C; Supplier 1: Digi-Key; Value: 220R
  R1 R2 R6004-R6011: Supplier Part Number 1: 311-220LRCT-ND
R6001 = RESISTOR0402-RES: as R5005 on sheet FMU_Power_FMU3_REV_C; Supplier 1: Digi-Key; Value: 1K
R6002 = RESISTOR0402-RES: as R1002 on sheet FMU_FMU3_REV_C; Supplier 1: Digi-Key; Value: 10K
R6016 = RESISTOR0402-RES: Thick Film Resistors - SMD 0402 68ohms 5% Tol; PARTNO: ERJ-2GEJ680X; 3DR_PARTNO: ECM0816; Supplier 1: Mouser; Value: 68R
R6017 = RESISTOR0402-RES: RES 1.5K OHM 1/16W 1% 0402 SMD; 3DR_PARTNO: ECM0803; PARTNO: RC0402FR-071K5L; Supplier 1: Digi-Key; Value: 1K5

## Sheet IO_FMU3_REV_C.SchDoc: Pixhawk_mini_8L.sch
size A4; Date: 18/08/2014 1:53:23 PM; DrawnBy: Philip Rowse; SheetNumber: 7; SheetTotal: 10
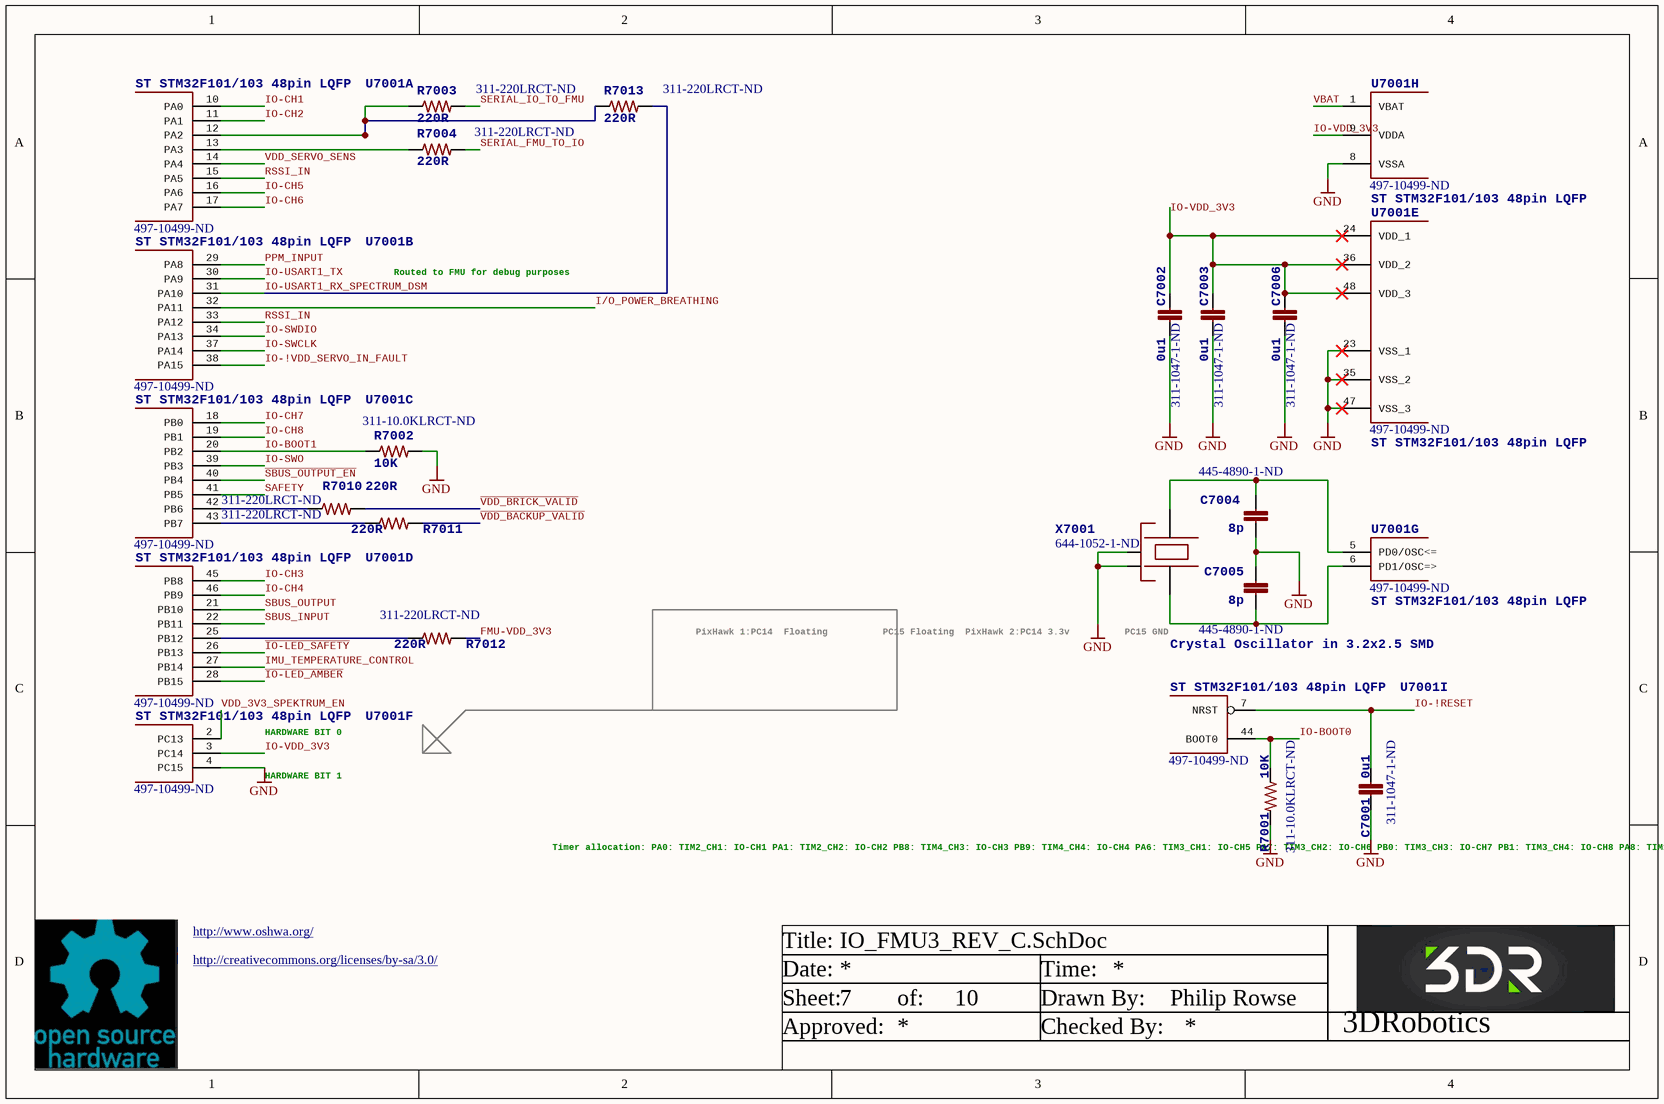
[diagram p6: IO_FMU3_REV_C.SchDoc]

### Parts
C7001  0u1  Supplier Part Number 1: 311-1047-1-ND  [0402-CAP]
C7002  0u1  Supplier Part Number 1: 311-1047-1-ND  [0402-CAP]
C7003  0u1  Supplier Part Number 1: 311-1047-1-ND  [0402-CAP]
C7004  8p  Supplier Part Number 1: 445-4890-1-ND  [0402-CAP]
C7005  8p  Supplier Part Number 1: 445-4890-1-ND  [0402-CAP]
C7006  0u1  Supplier Part Number 1: 311-1047-1-ND  [0402-CAP]
R7001  10K  Supplier Part Number 1: 311-10.0KLRCT-ND  [0402-RES]
R7002  10K  Supplier Part Number 1: 311-10.0KLRCT-ND  [0402-RES]
R7003  220R  Supplier Part Number 1: 311-220LRCT-ND  [0402-RES]
R7004  220R  Supplier Part Number 1: 311-220LRCT-ND  [0402-RES]
R7010  220R  Supplier Part Number 1: 311-220LRCT-ND  [0402-RES]
R7011  220R  Supplier Part Number 1: 311-220LRCT-ND  [0402-RES]
R7012  220R  Supplier Part Number 1: 311-220LRCT-ND  [0402-RES]
R7013  220R  Supplier Part Number 1: 311-220LRCT-ND  [0402-RES]
U7001  ST STM32F101/103 48pin LQFP  Supplier Part Number 1: 497-10499-ND  [TQFP48]  (parts A,B,C,D,E,F,G,H,I of 9)
X7001  Crystal Oscillator in 3.2x2.5 SMD  Supplier Part Number 1: 644-1052-1-ND  [OSCILLATOR-3.2X2.5]

### Nets
GND: C7001.P$1 C7002.P$2 C7003.P$2 C7004.P$2 C7005.P$1 C7006.P$2 R7001.P$2 R7002.P$2 U7001.4(PC15) U7001.8(VSSA) U7001.23(VSS_1) U7001.35(VSS_2) U7001.47(VSS_3) X7001.2(NC_2) X7001.4(NC_4)
FMU-VDD_3V3: R7012.P$2
I/O_POWER_BREATHING: U7001.32(PA11)
~{IO-LED_AMBER}: U7001.28(PB15)
~{IO-LED_SAFETY}: U7001.26(PB13)
IMU_TEMPERATURE_CONTROL: U7001.27(PB14)
IO-!RESET: C7001.P$2 U7001.7(NRST)
IO-!VDD_SERVO_IN_FAULT: U7001.38(PA15)
IO-BOOT0: R7001.P$1 U7001.44(BOOT0)
IO-BOOT1: R7002.P$1 U7001.20(PB2)
IO-CH1: U7001.10(PA0)
IO-CH2: U7001.11(PA1)
IO-CH3: U7001.45(PB8)
IO-CH4: U7001.46(PB9)
IO-CH5: U7001.16(PA6)
IO-CH6: U7001.17(PA7)
IO-CH7: U7001.18(PB0)
IO-CH8: U7001.19(PB1)
IO-SWCLK: U7001.37(PA14)
IO-SWDIO: U7001.34(PA13)
IO-SWO: U7001.39(PB3)
IO-USART1_RX_SPECTRUM_DSM: R7013.P$2 U7001.31(PA10)
IO-USART1_TX: U7001.30(PA9)
IO-VDD_3V3: C7002.P$1 C7003.P$1 C7006.P$1 U7001.3(PC14) U7001.9(VDDA) U7001.24(VDD_1) U7001.36(VDD_2) U7001.48(VDD_3)
PPM_INPUT: U7001.29(PA8)
RSSI_IN: U7001.15(PA5) U7001.33(PA12)
~{SBUS_OUTPUT_EN}: U7001.40(PB4)
SAFETY: U7001.41(PB5)
SBUS_INPUT: U7001.22(PB11)
SBUS_OUTPUT: U7001.21(PB10)
SERIAL_FMU_TO_IO: R7004.P$2
SERIAL_IO_TO_FMU: R7003.P$2
~{VDD_BACKUP_VALID}: R7011.P$2
~{VDD_BRICK_VALID}: R7010.P$2
VBAT: U7001.1(VBAT)
VDD_3V3_SPEKTRUM_EN: U7001.2(PC13)
VDD_SERVO_SENS: U7001.14(PA4)
NetC7004_P$1: C7004.P$1 U7001.5(PD0/OSC<=) X7001.3
NetC7005_P$2: C7005.P$2 U7001.6(PD1/OSC=>) X7001.1
NetR7003_P$1: R7003.P$1 R7013.P$1 U7001.12(PA2)
NetR7004_P$1: R7004.P$1 U7001.13(PA3)
NetR7010_P$1: R7010.P$1 U7001.42(PB6)
NetR7011_P$1: R7011.P$1 U7001.43(PB7)
NetR7012_P$1: R7012.P$1 U7001.25(PB12)

### Notes on the sheet
- Routed to FMU for debug purposes
- PixHawk 1:PC14  Floating
  PC15 Floating
  PixHawk 2:PC14 3.3v
  PC15 GND
- HARDWARE BIT 0
- HARDWARE BIT 1
- Timer allocation:
  PA0: TIM2_CH1: IO-CH1
  PA1: TIM2_CH2: IO-CH2
  PB8: TIM4_CH3: IO-CH3
  PB9: TIM4_CH4: IO-CH4
  PA6: TIM3_CH1: IO-CH5
  PA7: TIM3_CH2: IO-CH6
  PB0: TIM3_CH3: IO-CH7
  PB1: TIM3_CH4: IO-CH8
  PA8: TIM1_CH1: PPM_IN
  PA11: TIM1_CH4: RSSI_IN
- http://www.oshwa.org/
- http://creativecommons.org/licenses/by-sa/3.0/
- Title:
- Date:
- Time:
- Sheet:
- Approved:
- of:
- Drawn By:
- Checked By:
- 3DRobotics

### Library data of the parts
C7001-C7003 C7006 = CAP0402: as C1001 on sheet FMU_FMU3_REV_C; Supplier 1: Digi-Key; Value: 0u1
C7004 C7005 = CAP0402: as C1002 on sheet FMU_FMU3_REV_C; Supplier 1: Digi-Key; Value: 8p
R7001 R7002 = RESISTOR0402-RES: as R1002 on sheet FMU_FMU3_REV_C; Supplier 1: Digi-Key; Value: 10K
R7003 R7004 R7010-R7013 = RESISTOR0402-RES: as R1020 on sheet FMU_FMU3_REV_C; Supplier 1: Digi-Key; Value: 220R
U7001 = STM32F10XCXT6: MCU 32BIT ARM 64K FLASH 48LQFP; 3DR_PARTNO: EMC0842; Supplier 1: Digi-Key
X7001 = OSCILLATOR-3.2X2.5: as X1001 on sheet FMU_FMU3_REV_C; Supplier 1: Digi-Key; Value: 24MHz

## Sheet PWM_PPM_FMU3_REV_C.SchDoc: Pixhawk_mini_8L.sch
size A4; Date: 18/08/2014 1:53:26 PM; DrawnBy: Philip Rowse; SheetNumber: 8; SheetTotal: 10
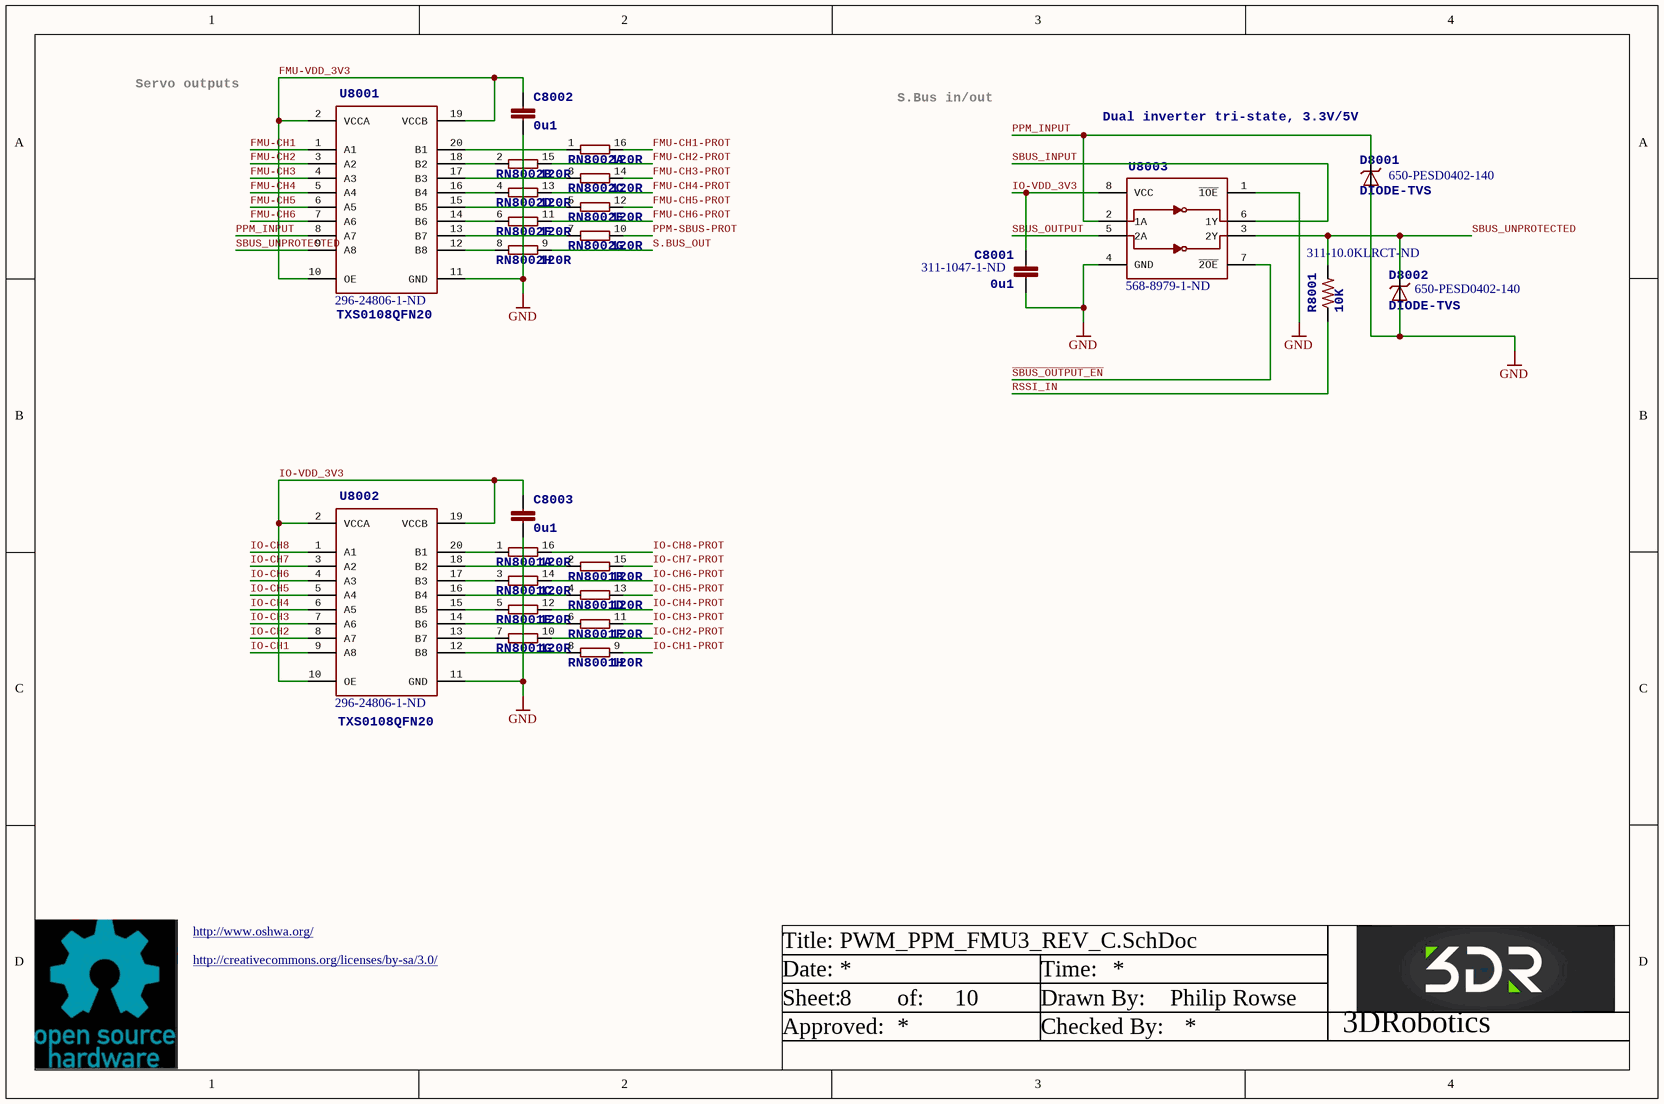
[diagram p7: PWM_PPM_FMU3_REV_C.SchDoc]

### Parts
C8001  0u1  Supplier Part Number 1: 311-1047-1-ND  [0402-CAP]
C8002  0u1  [0402-CAP]
C8003  0u1  [0402-CAP]
D8001  DIODE-TVS  Supplier Part Number 1: 650-PESD0402-140  [0402-TVS]
D8002  DIODE-TVS  Supplier Part Number 1: 650-PESD0402-140  [0402-TVS]
R8001  10K  Supplier Part Number 1: 311-10.0KLRCT-ND  [0402-RES]
RN8001  120R  [EXB2HV]  (parts A,B,C,D,E,F,G,H of 8)
RN8002  120R  [EXB2HV]  (parts A,B,C,D,E,F,G,H of 8)
U8001  TXS0108QFN20  Supplier Part Number 1: 296-24806-1-ND  [QFN20-RGY]
U8002  TXS0108QFN20  Supplier Part Number 1: 296-24806-1-ND  [QFN20-RGY]
U8003  Dual inverter tri-state, 3.3V/5V  Supplier Part Number 1: 568-8979-1-ND  [TSSOP8_SOT505-2]

### Nets
GND: C8001.P$2 C8002.P$2 C8003.P$2 D8001.A D8002.A U8001.11(GND) U8002.11(GND) U8003.1(~{1OE}) U8003.4(GND)
FMU-CH1: U8001.1(A1)
FMU-CH1-PROT: RN8002.16
FMU-CH2: U8001.3(A2)
FMU-CH2-PROT: RN8002.15
FMU-CH3: U8001.4(A3)
FMU-CH3-PROT: RN8002.14
FMU-CH4: U8001.5(A4)
FMU-CH4-PROT: RN8002.13
FMU-CH5: U8001.6(A5)
FMU-CH5-PROT: RN8002.12
FMU-CH6: U8001.7(A6)
FMU-CH6-PROT: RN8002.11
FMU-VDD_3V3: C8002.P$1 U8001.2(VCCA) U8001.10(OE) U8001.19(VCCB)
IO-CH1: U8002.9(A8)
IO-CH1-PROT: RN8001.9
IO-CH2: U8002.8(A7)
IO-CH2-PROT: RN8001.10
IO-CH3: U8002.7(A6)
IO-CH3-PROT: RN8001.11
IO-CH4: U8002.6(A5)
IO-CH4-PROT: RN8001.12
IO-CH5: U8002.5(A4)
IO-CH5-PROT: RN8001.13
IO-CH6: U8002.4(A3)
IO-CH6-PROT: RN8001.14
IO-CH7: U8002.3(A2)
IO-CH7-PROT: RN8001.15
IO-CH8: U8002.1(A1)
IO-CH8-PROT: RN8001.16
IO-VDD_3V3: C8001.P$1 C8003.P$1 U8002.2(VCCA) U8002.10(OE) U8002.19(VCCB) U8003.8(VCC)
PPM-SBUS-PROT: RN8002.10
PPM_INPUT: D8001.C U8001.8(A7) U8003.2(1A)
RSSI_IN: R8001.P$1
S.BUS_OUT: RN8002.9
~{SBUS_OUTPUT_EN}: U8003.7(~{2OE})
SBUS_INPUT: U8003.6(1Y)
SBUS_OUTPUT: U8003.5(2A)
SBUS_UNPROTECTED: D8002.C R8001.P$2 U8001.9(A8) U8003.3(2Y)
NetRN8001_1: RN8001.1 U8002.20(B1)
NetRN8001_2: RN8001.2 U8002.18(B2)
NetRN8001_3: RN8001.3 U8002.17(B3)
NetRN8001_4: RN8001.4 U8002.16(B4)
NetRN8001_5: RN8001.5 U8002.15(B5)
NetRN8001_6: RN8001.6 U8002.14(B6)
NetRN8001_7: RN8001.7 U8002.13(B7)
NetRN8001_8: RN8001.8 U8002.12(B8)
NetRN8002_1: RN8002.1 U8001.20(B1)
NetRN8002_2: RN8002.2 U8001.18(B2)
NetRN8002_3: RN8002.3 U8001.17(B3)
NetRN8002_4: RN8002.4 U8001.16(B4)
NetRN8002_5: RN8002.5 U8001.15(B5)
NetRN8002_6: RN8002.6 U8001.14(B6)
NetRN8002_7: RN8002.7 U8001.13(B7)
NetRN8002_8: RN8002.8 U8001.12(B8)

### Notes on the sheet
- Servo outputs
- S.Bus in/out
- http://www.oshwa.org/
- http://creativecommons.org/licenses/by-sa/3.0/
- Title:
- Date:
- Time:
- Sheet:
- Approved:
- of:
- Drawn By:
- Checked By:
- 3DRobotics

### Library data of the parts
C8001-C8003 = CAP0402: as C1001 on sheet FMU_FMU3_REV_C; Supplier 1: Digi-Key; Value: 0u1
  C8002 C8003: Supplier Part Number 1: 311-1047-1-ND
D8001 D8002 = DIODE-TVS: TVS DIODE 14VWM 40VC 0402; 3DR_PARTNO: ECM0837; PARTNO: PESD0402-140; Value: 40v; Supplier 1: Mouser
R8001 = RESISTOR0402-RES: as R1002 on sheet FMU_FMU3_REV_C; Supplier 1: Digi-Key; Value: 10K
RN8001 RN8002 = 8R-NEXB2HV-220R: RES ARRAY 120 OHM 8 RES 1506; PARTNO: EXB-2HV121JV; 3DR_PARTNO: ECM0266; OC_FARNELL: unknown; OC_NEWARK: unknown; Supplier 1: Digi-Key; Supplier Part Number 1: Y1121CT-ND; Value: 120R
U8001 U8002 = TXS0108QFN20: as U3001 on sheet SERIAL_FMU3_REV_C; Supplier 1: Digi-Key
U8003 = 74LVC2G240-TSSOP-8: IC INVERTER DUAL 4-INPUT 8TSSOP; 3DR_PARTNO: ECM0817; PARTNO: 74LVC2G240DP,125; Value: INV; Supplier 1: Digi-Key

## Sheet 80PIN_FMU3_REV_C.SchDoc: Pixhawk_mini_8L.sch
size A4; Date: 18/08/2014 1:53:28 PM; DrawnBy: Philip Rowse; SheetNumber: 9; SheetTotal: 10
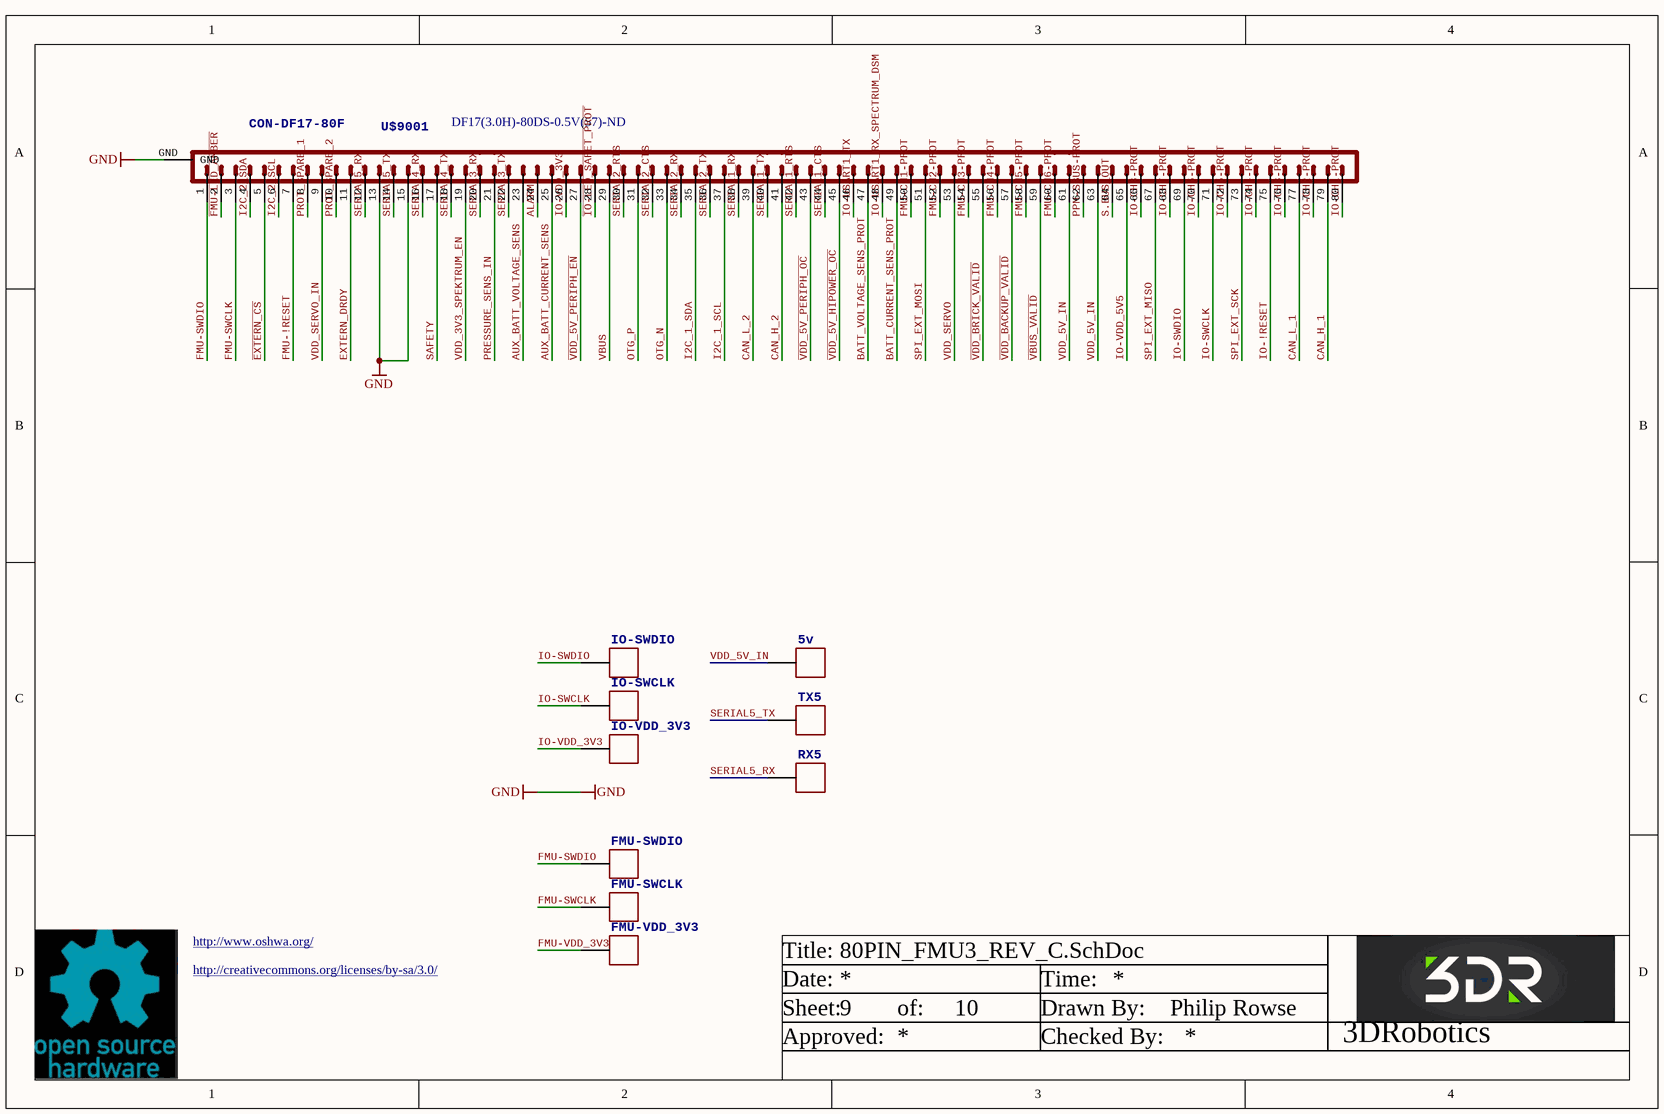
[diagram p8: 80PIN_FMU3_REV_C.SchDoc]

### Parts
5v  PAD.04  [PAD.04X.04]  (value not drawn)
FMU-SWCLK  PAD.04  [PAD.04X.04]  (value not drawn)
FMU-SWDIO  PAD.04  [PAD.04X.04]  (value not drawn)
FMU-VDD_3V3  PAD.04  [PAD.04X.04]  (value not drawn)
IO-SWCLK  PAD.04  [PAD.04X.04]  (value not drawn)
IO-SWDIO  PAD.04  [PAD.04X.04]  (value not drawn)
IO-VDD_3V3  PAD.04  [PAD.04X.04]  (value not drawn)
RX5  PAD.04  [PAD.04X.04]  (value not drawn)
TX5  PAD.04  [PAD.04X.04]  (value not drawn)
U$9001  CON-DF17-80F  Supplier Part Number 1: DF17(3.0H)-80DS-0.5V(57)-ND  [CON-DF17-80F]

### Nets
GND: U$9001.13 U$9001.15 U$9001.GND
ALARM: U$9001.24
AUX_BATT_CURRENT_SENS: U$9001.25
AUX_BATT_VOLTAGE_SENS: U$9001.23
BATT_CURRENT_SENS_PROT: U$9001.49
BATT_VOLTAGE_SENS_PROT: U$9001.47
CAN_H_1: U$9001.79
CAN_H_2: U$9001.41
CAN_L_1: U$9001.77
CAN_L_2: U$9001.39
~{EXTERN_CS}: U$9001.5
EXTERN_DRDY: U$9001.11
~{FMU-LED_AMBER}: U$9001.2
FMU-!RESET: U$9001.7
FMU-CH1-PROT: U$9001.50
FMU-CH2-PROT: U$9001.52
FMU-CH3-PROT: U$9001.54
FMU-CH4-PROT: U$9001.56
FMU-CH5-PROT: U$9001.58
FMU-CH6-PROT: U$9001.60
FMU-SWCLK: FMU-SWCLK.P$1 U$9001.3
FMU-SWDIO: FMU-SWDIO.P$1 U$9001.1
FMU-VDD_3V3: FMU-VDD_3V3.P$1
I2C_1_SCL: U$9001.37
I2C_1_SDA: U$9001.35
I2C_2_SCL: U$9001.6
I2C_2_SDA: U$9001.4
~{IO-LED_SAFET_PROT}: U$9001.28
IO-!RESET: U$9001.75
IO-CH1-PROT: U$9001.80
IO-CH2-PROT: U$9001.78
IO-CH3-PROT: U$9001.76
IO-CH4-PROT: U$9001.74
IO-CH5-PROT: U$9001.72
IO-CH6-PROT: U$9001.70
IO-CH7-PROT: U$9001.68
IO-CH8-PROT: U$9001.66
IO-SWCLK: IO-SWCLK.P$1 U$9001.71
IO-SWDIO: IO-SWDIO.P$1 U$9001.69
IO-USART1_RX_SPECTRUM_DSM: U$9001.48
IO-USART1_TX: U$9001.46
IO-VDD_3V3: IO-VDD_3V3.P$1 U$9001.26
IO-VDD_5V5: U$9001.65
OTG_N: U$9001.33
OTG_P: U$9001.31
PPM-SBUS-PROT: U$9001.62
PRESSURE_SENS_IN: U$9001.21
PROT_SPARE_1: U$9001.8
PROT_SPARE_2: U$9001.10
S.BUS_OUT: U$9001.64
SAFETY: U$9001.17
SERIAL1_CTS: U$9001.44
SERIAL1_RTS: U$9001.42
SERIAL1_RX: U$9001.38
SERIAL1_TX: U$9001.40
SERIAL2_CTS: U$9001.32
SERIAL2_RTS: U$9001.30
SERIAL2_RX: U$9001.34
SERIAL2_TX: U$9001.36
SERIAL3_RX: U$9001.20
SERIAL3_TX: U$9001.22
SERIAL4_RX: U$9001.16
SERIAL4_TX: U$9001.18
SERIAL5_RX: RX5.P$1 U$9001.12
SERIAL5_TX: TX5.P$1 U$9001.14
SPI_EXT_MISO: U$9001.67
SPI_EXT_MOSI: U$9001.51
SPI_EXT_SCK: U$9001.73
~{VBUS_VALID}: U$9001.59
~{VDD_5V_HIPOWER_OC}: U$9001.45
~{VDD_5V_PERIPH_EN}: U$9001.27
~{VDD_5V_PERIPH_OC}: U$9001.43
~{VDD_BACKUP_VALID}: U$9001.57
~{VDD_BRICK_VALID}: U$9001.55
VBUS: U$9001.29
VDD_3V3_SPEKTRUM_EN: U$9001.19
VDD_5V_IN: 5v.P$1 U$9001.61 U$9001.63
VDD_SERVO: U$9001.53
VDD_SERVO_IN: U$9001.9

### Notes on the sheet
- http://www.oshwa.org/
- http://creativecommons.org/licenses/by-sa/3.0/
- Title:
- Date:
- Time:
- Sheet:
- Approved:
- of:
- Drawn By:
- Checked By:
- 3DRobotics

### Library data of the parts
5v FMU-SWCLK FMU-SWDIO FMU-VDD_3V3 IO-SWCLK IO-SWDIO IO-VDD_3V3 RX5 TX5 = PAD.04: BOM: EXCLUDE; PARTNO: *
U$9001 = CON-DF17-80F: CONN RECEPT 80POS .5MM SMD W/FIT; 3DR_PARTNO: ECM0518; PARTNO: DF17(3.0H)-80DS-0.5V(57); Supplier 1: Digi-Key

## Sheet IO_PWR_FMU3_REV_C.SchDoc: Pixhawk_mini_8L.sch
size A4; Date: 18/08/2014 1:53:31 PM; DrawnBy: Philip Rowse; SheetNumber: 10; SheetTotal: 10
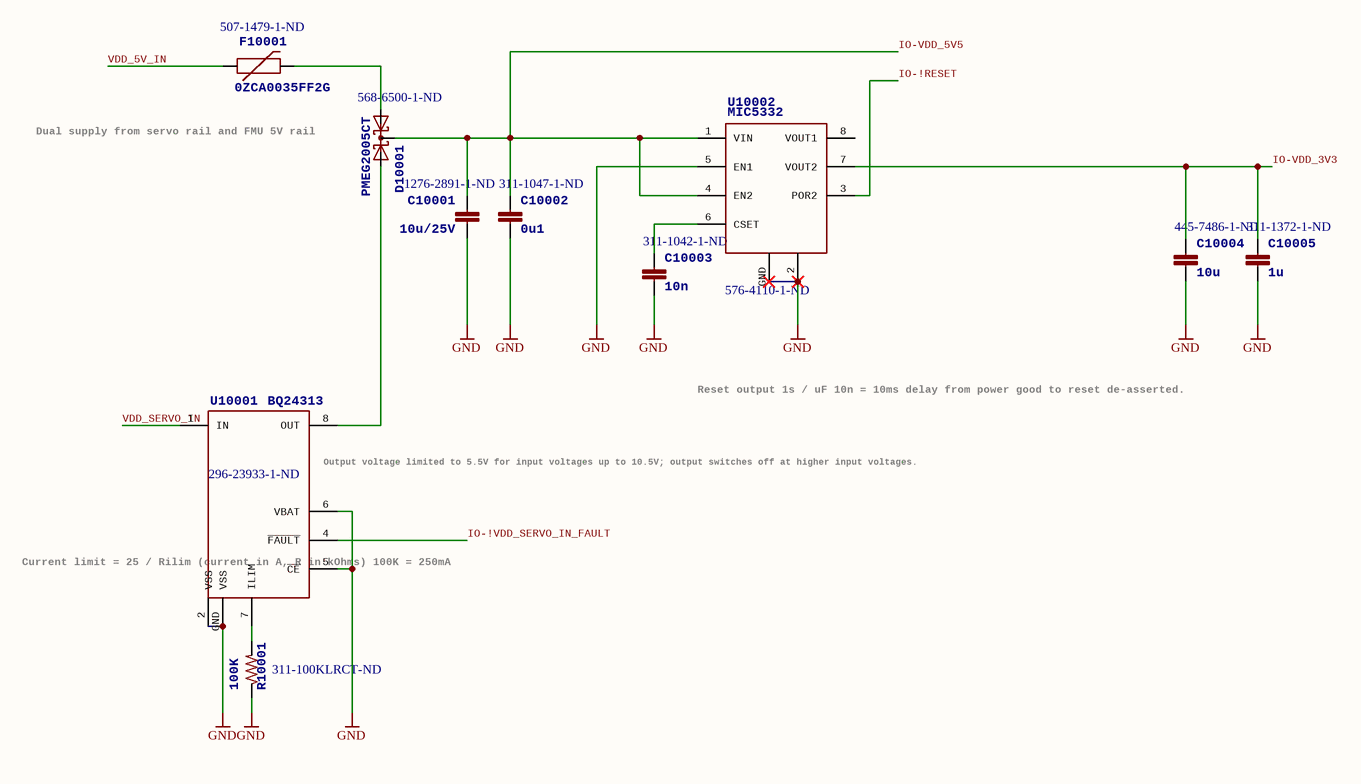
[diagram p9: IO_PWR_FMU3_REV_C.SchDoc]

### Parts
C10001  10u/25V  Supplier Part Number 1: 1276-2891-1-ND  [0805-CAP]
C10002  0u1  Supplier Part Number 1: 311-1047-1-ND  [0402-CAP]
C10003  10n  Supplier Part Number 1: 311-1042-1-ND  [0402-CAP]
C10004  10u  Supplier Part Number 1: 445-7486-1-ND  [0603-CAP]
C10005  1u  Supplier Part Number 1: 311-1372-1-ND  [0603-CAP]
D10001  PMEG2005CT  Supplier Part Number 1: 568-6500-1-ND  [SOT23-3]
F10001  0ZCA0035FF2G  Supplier Part Number 1: 507-1479-1-ND  [PTC-1206]
R10001  100K  Supplier Part Number 1: 311-100KLRCT-ND  [0402-RES]
U10001  BQ24313  Supplier Part Number 1: 296-23933-1-ND  [QFN8-DSG]
U10002  MIC5332  Supplier Part Number 1: 576-4110-1-ND  [MLF-8-EPAD]

### Nets
GND: C10001.P$2 C10002.P$2 C10003.P$2 C10004.P$2 C10005.P$2 R10001.P$1 U10001.2(VSS) U10001.5(~{CE}) U10001.6(VBAT) U10001.GND(VSS) U10002.2(GND) U10002.5(EN1) U10002.GND
IO-!RESET: U10002.3(POR2)
IO-!VDD_SERVO_IN_FAULT: U10001.4(~{FAULT})
IO-VDD_3V3: C10004.P$1 C10005.P$1 U10002.7(VOUT2)
IO-VDD_5V5: C10001.P$1 C10002.P$1 D10001.3(CC) U10002.1(VIN) U10002.4(EN2)
VDD_5V_IN: F10001.1
VDD_SERVO_IN: U10001.1(IN)
NetC10003_P$1: C10003.P$1 U10002.6(CSET)
NetD10001_1: D10001.1(A1) F10001.2
NetD10001_2: D10001.2(A2) U10001.8(OUT)
NetR10001_P$2: R10001.P$2 U10001.7(ILIM)

Not connected (* = marked no-connect by the designer): U10002 8(VOUT1)

### Notes on the sheet
- Dual supply from
  servo rail and FMU 5V rail
- Reset output 1s / uF
  10n = 10ms delay from power good
  to reset de-asserted.
- (near U10001) Output voltage limited to 5.5V for
  input voltages up to 10.5V; output
  switches off at higher input voltages.
- (near U10001) Current limit = 25 / Rilim
  (current in A, R in kOhms)
  100K = 250mA
- http://www.oshwa.org/
- http://creativecommons.org/licenses/by-sa/3.0/
- Title:
- Date:
- Time:
- Sheet:
- Approved:
- of:
- Drawn By:
- Checked By:
- 3DRobotics

### Library data of the parts
C10001 = CAP0805: as C5002 on sheet FMU_Power_FMU3_REV_C; Supplier 1: Digi-Key
C10002 = CAP0402: as C1001 on sheet FMU_FMU3_REV_C; Supplier 1: Digi-Key; Value: 0u1
C10003 = CAP0402: as C5003 on sheet FMU_Power_FMU3_REV_C; Supplier 1: Digi-Key; Value: 10n
C10004 = CAP0603: CAP CER 10UF 10V 10% X5R 0603; PARTNO: C1608X5R1A106K080AC; 3DR_PARTNO: ECM0712; Supplier 1: Digi-Key; Value: 10u
C10005 = CAP0603: as C5004 on sheet FMU_Power_FMU3_REV_C; Supplier 1: Digi-Key; Value: 1u
D10001 = PMEG2005CT: DIODE SCHOTTKY 20V 500MA TO236AB; 3DR_PARTNO: ECM0838; PARTNO: PMEG2005CT; Supplier 1: Digi-Key; Value: 20V
F10001 = PTCSMD: PTC RESTTBLE 0.35A 16V CHIP 1206; 3DR_PARTNO: ECM0802; PARTNO: 0ZCA0035FF2G; Supplier 1: Digi-Key; Value: 0.35A
R10001 = RESISTOR0402-RES: RES 100K OHM 1/16W 1% 0402 SMD; 3DR_PARTNO: ECM0818; PARTNO: RC0402FR-07100KL; Supplier 1: Digi-Key; Value: 100K
U10001 = BQ24313: IC LI+ CHARGER FRONT END 8-SON; 3DR_PARTNO: ECM0824; PARTNO: BQ24313DSGT; Supplier 1: Digi-Key
U10002 = MIC5332: as U5001 on sheet FMU_Power_FMU3_REV_C; Supplier 1: Digi-Key; Value: 3.3V

## Sheet CHANGE_FMU3_REV_D.SchDoc: Pixhawk_mini_8L.sch
size A4; Date: 18/08/2014 1:53:31 PM; DrawnBy: Philip Rowse; SheetNumber: 10; SheetTotal: 10
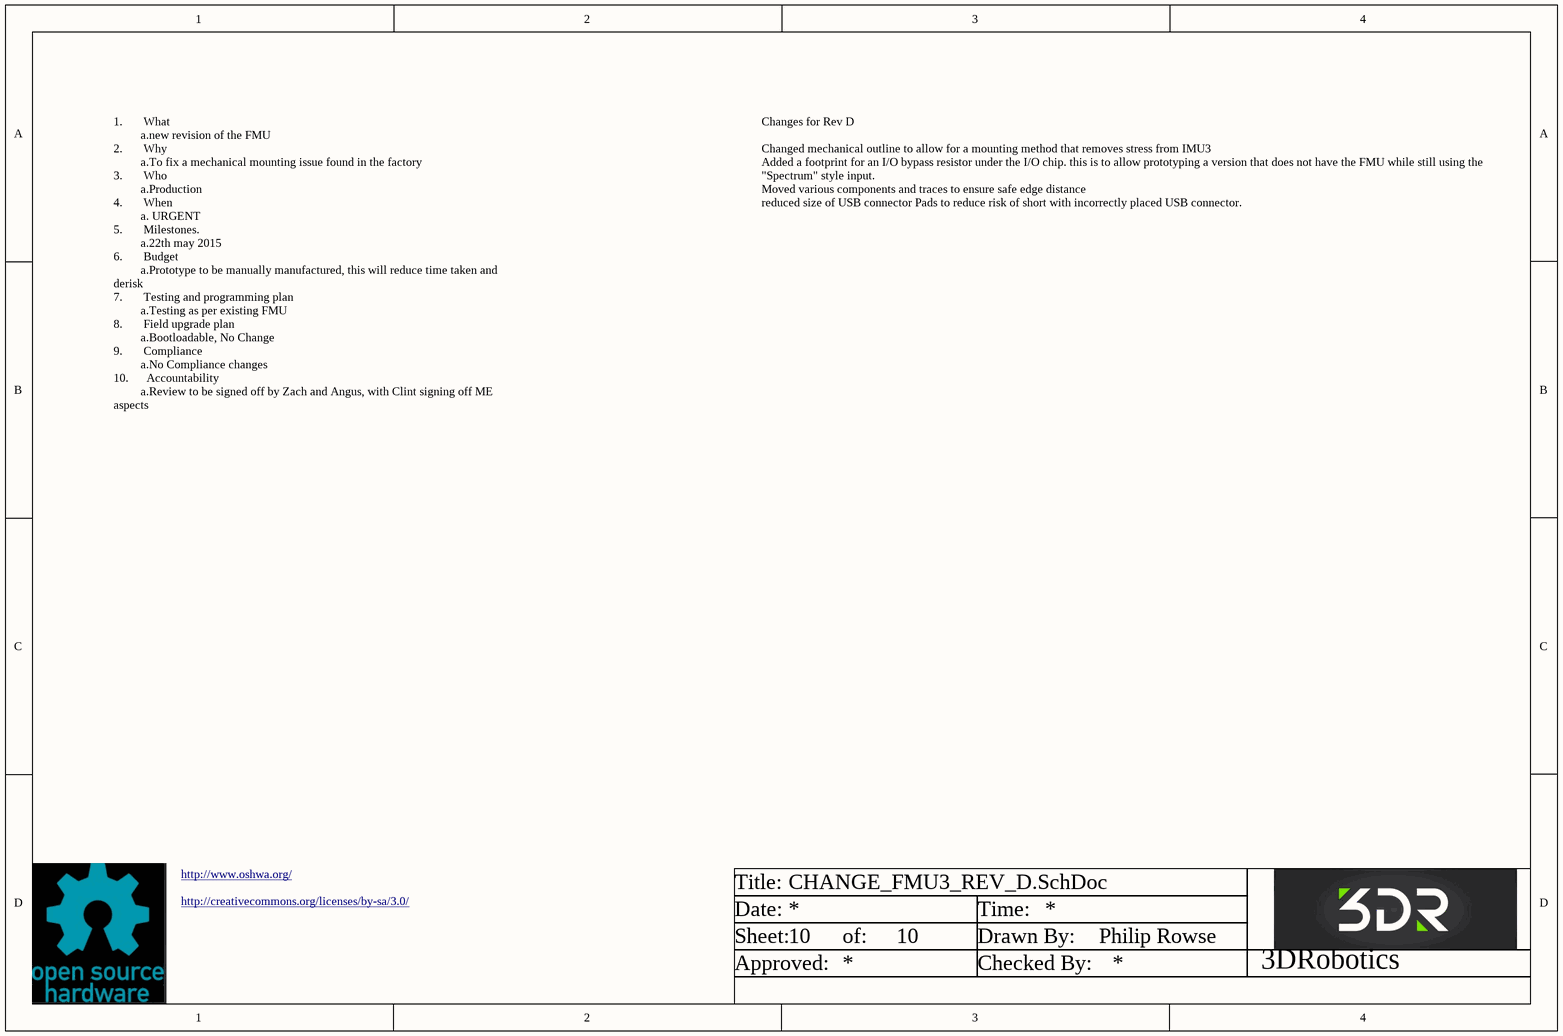
[diagram p10: CHANGE_FMU3_REV_D.SchDoc]

### Notes on the sheet
- Changes for Rev D
  Changed mechanical outline to allow for a mounting method that removes stress from IMU3
  Added a footprint for an I/O bypass resistor under the I/O chip. this is to allow prototyping a version that does not have the FMU while still using the "Spectrum" style input.
  Moved various components and traces to ensure safe edge distance
  reduced size of USB connector Pads to reduce risk of short with incorrectly placed USB connector.
- 1.       What
  a.new revision of the FMU
  2.       Why
  a.To fix a mechanical mounting issue found in the factory
  3.       Who
  a.Production
  4.       When
  a. URGENT
  5.       Milestones.
  a.22th may 2015
  6.       Budget
  a.Prototype to be manually manufactured, this will reduce time taken and derisk
  7.       Testing and programming plan
  a.Testing as per existing FMU
  8.       Field upgrade plan
  a.Bootloadable, No Change
  9.       Compliance
  a.No Compliance changes
  10.      Accountability
  a.Review to be signed off by Zach and Angus, with Clint signing off ME aspects
- http://www.oshwa.org/
- http://creativecommons.org/licenses/by-sa/3.0/
- Title:
- Date:
- Time:
- Sheet:
- Approved:
- of:
- Drawn By:
- Checked By:
- 3DRobotics